# Altium project PDB26.PrjPcb (part 2 of 3)

## Sheet 12V_Buck_fans.SchDoc
size A; SheetNumber: 7; SheetTotal: 17
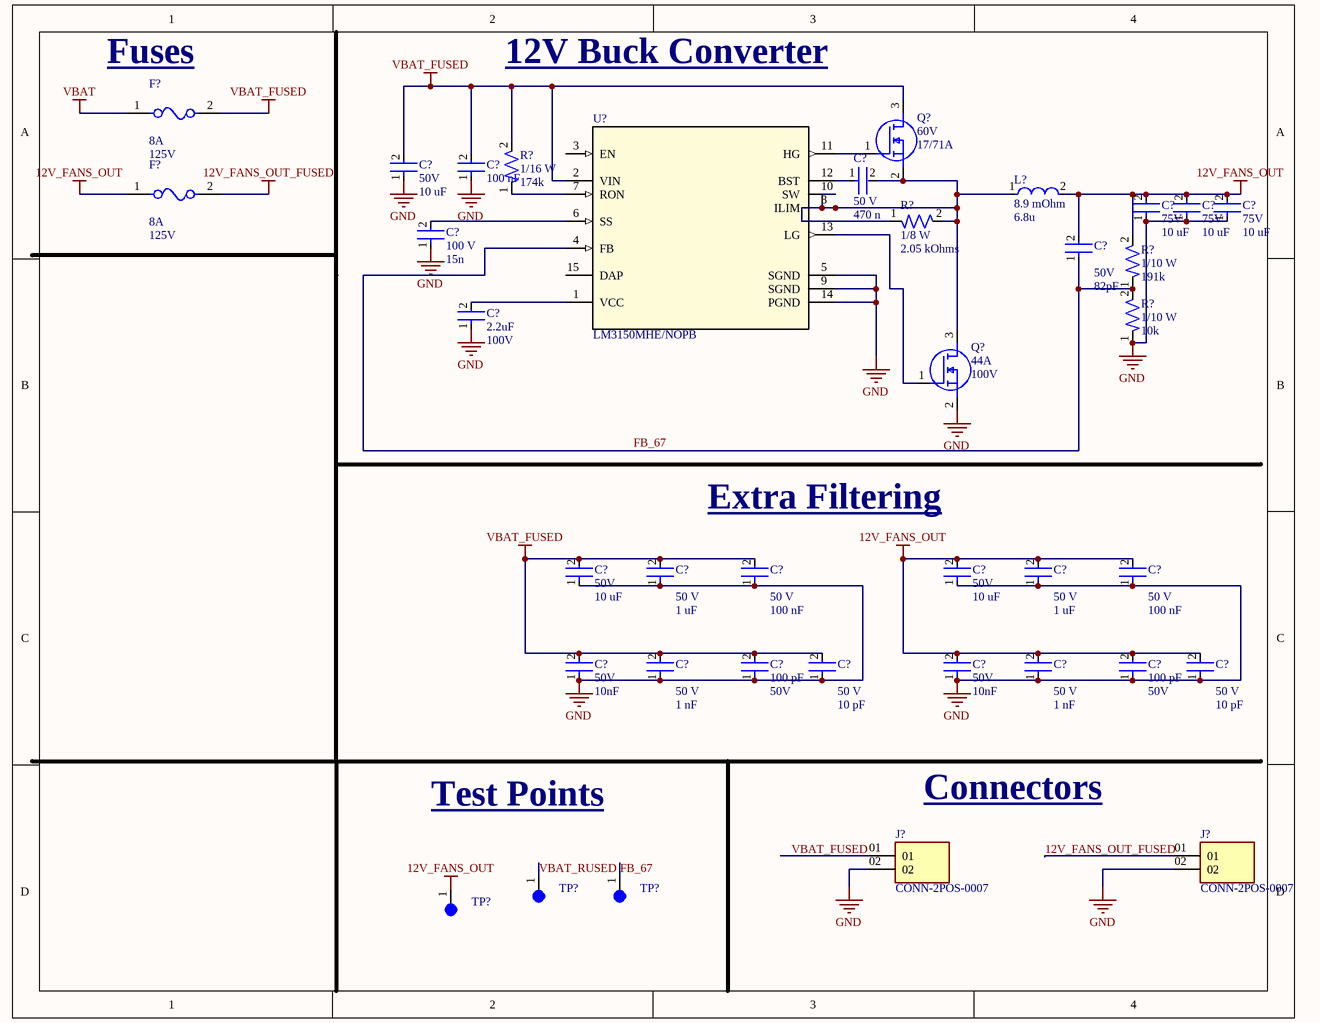
[diagram p6: 12V_Buck_fans.SchDoc]

### Parts
(Parts that share a designator on the sheet are numbered #1, #2 ... from top to bottom, then left to right.)
C?#113  Capacitance: 100 nF  [CAP-0603]  (hidden comment: GMC10X7S104K100NT)
C?#114  Voltage: 50V  Capacitance: 10 uF  [CAP-1210]  (hidden comment: CL32B106KBJNNNE)
C?#115  Voltage: 50 V  Capacitance: 470 n  [CAP-0805]  (hidden comment: CC0805ZRY5V9BB474)
C?#116  Voltage: 75V  Capacitance: 10 uF  [CAP-1210-0001]  (hidden comment: C3225X7R1N106K250AC)
C?#117  Voltage: 75V  Capacitance: 10 uF  [CAP-1210-0001]  (hidden comment: C3225X7R1N106K250AC)
C?#118  Voltage: 75V  Capacitance: 10 uF  [CAP-1210-0001]  (hidden comment: C3225X7R1N106K250AC)
C?#119  Voltage: 100 V  Capacitance: 15n  [CAP-0805]  (hidden comment: CC0805KRX7R0BB153)
C?#120  Voltage: 50V  Capacitance: 82pF  [CAP-0805]  (hidden comment: CC0805JRNPO9BN820)
C?#121  Capacitance: 2.2uF  Voltage: 100V  [CAP-1206]  (hidden comment: CC1206KKX7R0BB225)
C?#122  Voltage: 50 V  Capacitance: 1 uF  [CAP-0805]  (hidden comment: CC0805KKX7R9BB105)
C?#123  Voltage: 50 V  Capacitance: 100 nF  [CAP-0805]  (hidden comment: CC0805KRX7R9BB104)
C?#124  Voltage: 50 V  Capacitance: 1 uF  [CAP-0805]  (hidden comment: CC0805KKX7R9BB105)
C?#125  Voltage: 50 V  Capacitance: 100 nF  [CAP-0805]  (hidden comment: CC0805KRX7R9BB104)
C?#126  Voltage: 50V  Capacitance: 10 uF  [CAP-1210]  (hidden comment: CL32B106KBJNNNE)
C?#127  Voltage: 50V  Capacitance: 10 uF  [CAP-1210]  (hidden comment: CL32B106KBJNNNE)
C?#128  Voltage: 50 V  Capacitance: 1 nF  [CAP-0402]  (hidden comment: CC0402KRX7R9BB102)
C?#129  Voltage: 50 V  Capacitance: 10 pF  [CAP-0402]  (hidden comment: CC0402JRNPO9BN100)
C?#130  Voltage: 50 V  Capacitance: 1 nF  [CAP-0402]  (hidden comment: CC0402KRX7R9BB102)
C?#131  Voltage: 50 V  Capacitance: 10 pF  [CAP-0402]  (hidden comment: CC0402JRNPO9BN100)
C?#132  Voltage: 50V  Capacitance: 10nF  [CAP-0805]  (hidden comment: GRM2195C1H103JA01D)
C?#133  Capacitance: 100 pF  Voltage: 50V  [CAP-0402]  (hidden comment: CC0402JRNPO9BN101)
C?#134  Voltage: 50V  Capacitance: 10nF  [CAP-0805]  (hidden comment: GRM2195C1H103JA01D)
C?#135  Capacitance: 100 pF  Voltage: 50V  [CAP-0402]  (hidden comment: CC0402JRNPO9BN101)
F?#11  Fuse Current: 8A  Voltage Rating: 125V  [FUSE-0001]  (hidden comment: 01550900M)
F?#12  Fuse Current: 8A  Voltage Rating: 125V  [FUSE-0001]  (hidden comment: 01550900M)
J?#11  CONN-2POS-0007  [SAMTEC_HFWJ-02-02-T-S]
J?#12  CONN-2POS-0007  [SAMTEC_HFWJ-02-02-T-S]
L?#6  Resistance: 8.9 mOhm  Inductance: 6.8u  (hidden comment: XAL1010-682MED)
Q?#12  Vdss: 60V  Current: 17/71A  [NTMFS5C670NLT1G_ONS]  (hidden comment: NTMFS5C670NLT1G)
Q?#13  Current: 44A  Vdss: 100V  [TRANS_CSD19534Q5A]  (hidden comment: CSD19534Q5A)
R?#24  Power: 1/16 W  Resistance: 174k  [RES-0402]  (hidden comment: RC0402FR-07174KL)
R?#25  Power: 1/8 W  Resistance: 2.05 kOhms  [RES-0805]  (hidden comment: RC0805FR-072K05L)
R?#26  Power: 1/10 W  Resistance: 191k  [RES-0603]  (hidden comment: AC0603FR-07191KL)
R?#27  Power: 1/10 W  Resistance: 10k  [CAP-0603]  (hidden comment: RC0603FR-0710KL)
TP?#17  5003  [TEST-POINT-0001]  (value not drawn)
TP?#18  5003  [TEST-POINT-0001]  (value not drawn)
TP?#19  5003  [TEST-POINT-0001]  (value not drawn)
U?#6  LM3150MHE/NOPB  [MXA14A]

### Nets
12V_FANS_OUT: C?#116.2 C?#117.2 C?#118.2 C?#120.2 C?#124.2 C?#125.2 C?#127.2 C?#130.2 C?#131.2 C?#134.2 C?#135.2 F?#12.1 L?#6.2 R?#26.2 TP?#19.1
12V_FANS_OUT_FUSED: F?#12.2 J?#12.01
GND: C?#113.1 C?#114.1 C?#116.1 C?#117.1 C?#118.1 C?#119.1 C?#121.1 C?#122.1 C?#123.1 C?#124.1 C?#125.1 C?#126.1 C?#127.1 C?#128.1 C?#129.1 C?#130.1 C?#131.1 C?#132.1 C?#133.1 C?#134.1 C?#135.1 J?#11.02 J?#12.02 Q?#13.2(S) R?#27.1 U?#6.5(SGND) U?#6.9(SGND) U?#6.14(PGND)
VBAT: F?#11.1
VBAT_FUSED: C?#113.2 C?#114.2 C?#122.2 C?#123.2 C?#126.2 C?#128.2 C?#129.2 C?#132.2 C?#133.2 F?#11.2 Q?#12.3(D) R?#24.2 U?#6.2(VIN)
FB_67: C?#120.1 R?#26.1 R?#27.2 TP?#18.1 U?#6.4(FB)
VBAT_RUSED: TP?#17.1
NetC?#115_1: C?#115.1 U?#6.12(BST)
NetC?#115_2: C?#115.2 L?#6.1 Q?#12.2(S) Q?#13.3(D) R?#25.1 R?#25.2 U?#6.8(ILIM) U?#6.10(SW)
NetC?#119_2: C?#119.2 U?#6.6(SS)
NetC?#121_2: C?#121.2 U?#6.1(VCC)
NetQ?#12_1: Q?#12.1(G) U?#6.11(HG)
NetQ?#13_1: Q?#13.1(G) U?#6.13(LG)
NetR?#24_1: R?#24.1 U?#6.7(RON)

Not connected (* = marked no-connect by the designer): J?#11 01; U?#6 3(EN) 15(DAP)

### Notes on the sheet
- (near F?#11) Fuses
- 12V Buck Converter
- (near C?#123) Extra Filtering
- Test Points
- Connectors
- Labels drawn without touching a wire or pin: VBAT_FUSED

### Library data of the parts
C?#113 = CAP-100N-0001: 0.1 µF ±10% 100V Ceramic Capacitor X7S 0603 (1608 Metric)
C?#114 C?#126 C?#127 = CAP-10U-0002: CAP CER 10UF 50V X7R 1210; Device Class: Ceramic; Size: 1210; ComponentLink1Description: Datasheet; ComponentLink1URL: https://mm.digikey.com/Volume0/opasdata/d220001/medias/docus/41/CL32B106KBJNNNE_Spec.pdf
C?#115 = CAP-470N-0002: 0.47 µF -20%, +80% 50V Ceramic Capacitor Y5V (F) 0805 (2012 Metric)
C?#116-C?#118 = CAP-10U-0003: CAP CER 10UF 75V X7R 1210; Device Class: Ceramic; Size: 1210; ComponentLink1Description: Datasheet; ComponentLink1URL: https://mm.digikey.com/Volume0/opasdata/d220001/medias/docus/41/CL32B106KBJNNNE_Spec.pdf
C?#119 = CAP-15N-0001: 0.015 µF ±10% 100V Ceramic Capacitor X7R 0805 (2012 Metric)
C?#120 = CAP-82P-0001: 82 pF ±5% 50V Ceramic Capacitor C0G, NP0 0805 (2012 Metric)
C?#121 = CAP-2.2U-0001: CAP CER 2.2UF 100V X7R 1206; Device Class: Ceramic; Size: 1206; ComponentLink1Description: Datasheet; ComponentLink1URL: https://www.yageo.com/upload/media/product/productsearch/datasheet/mlcc/UPY-GPHC_X7R_6.3V-to-250V_24.pdf
C?#122 C?#124 = CAP-1U-0001: 1 µF ±10% 50V Ceramic Capacitor X7R 0805 (2012 Metric)
C?#123 C?#125 = CAP-100N-0002: 0.1 µF ±10% 50V Ceramic Capacitor X7R 0805 (2012 Metric)
C?#128 C?#130 = CAP-1N-0001: 1000 pF ±10% 50V Ceramic Capacitor X7R 0402 (1005 Metric)
C?#129 C?#131 = CAP-10P-0001: 10 pF ±5% 50V Ceramic Capacitor C0G, NP0 0402 (1005 Metric)
C?#132 C?#134 = CAP-10N-0001: CAP CER 10000PF 50V C0G/NP0 0805; Device Class: Ceramic; Size: 0805; ComponentLink1Description: Datasheet; ComponentLink1URL: https://search.murata.co.jp/Ceramy/image/img/A01X/G101/ENG/GRM2195C1H103JA01-01.pdf
C?#133 C?#135 = CAP-100P-0001: CAP CER 100PF 50V C0G/NPO 0402; Device Class: Ceramic; Size: 0402; ComponentLink1Description: Datasheet; ComponentLink1URL: https://www.yageo.com/upload/media/product/productsearch/datasheet/mlcc/UPY-GP_NP0_16V-to-50V_18.pdf
F?#11 F?#12 = FUSE-0001: FUSE BLOK CARTRIDGE 125V 10A SMD; ComponentLink2Description: Datasheet; ComponentLink2URL: https://www.littelfuse.com/~/media/electronics/datasheets/fuses/littelfuse_fuse_154_154t_154l_154tl_datasheet.pdf.pdf
J?#11 J?#12 = CONN-2POS-0007: Conn Unshrouded Header HDR 2 POS 3.96mm Solder ST Thru-Hole Bulk; MF: Samtec; MP: HFWJ-02-02-T-S; SnapEDA_Link: https://www.snapeda.com/parts/HFWJ-02-02-T-S/Samtec/view-part/?ref=snap; Package: None; Value: *; Check_prices: https://www.snapeda.com/parts/HFWJ-02-02-T-S/Samtec/view-part/?ref=eda
L?#6 = IND-6.8u-0001: 6.8 µH Shielded Molded Inductor 14 A 8.9mOhm Max Nonstandard
Q?#12 = MOS-17/71A-0001: MOSFET N-CH 60V 17A/71A 5DFN; Manufacturer_Name: onsemi; Vth: 2V; Copyright: Copyright (C) 2025 Ultra Librarian. All rights reserved.; Manufacturer_Part_Number: NTMFS5C670NLT1G; RefDes: RefDes; Type: Type
Q?#13 = MOS-44A-0001: 100V, N ch NexFET MOSFET, single SON5x6, 15.1mOhm 8-VSONP -55 to 150; MF: Texas Instruments; Vth: 3.4V; Mouser-Purchase-URL: https://snapeda.com/shop?store=Mouser&id=485742; Package: VSONP-8 Texas Instruments; Texas_Instruments-Purchase-URL: https://snapeda.com/shop?store=Texas+Instruments&id=485742; Value: *; Price: None; DigiKey-Purchase-URL: https://snapeda.com/shop?store=DigiKey&id=485742; MP: CSD19534Q5A; SnapEDA_Link: https://www.snapeda.com/parts/CSD19534Q5A/Texas%20Instruments/view-part/485742/?ref=snap; Availability: Good
R?#24 = RES-174K-0001: RES 174K OHM 1% 1/16W 0402
R?#25 = RES-2.05k-0001: 2.05 kOhms ±1% 0.125W, 1/8W Chip Resistor 0805 (2012 Metric) Moisture Resistant Thick Film
R?#26 = RES-191K-001: 191 kOhms ±1% 0.1W, 1/10W Chip Resistor 0603 (1608 Metric) Automotive AEC-Q200, Moisture Resistant Thick Film
R?#27 = RES-10k-0002: 10 kOhms ±1% 0.1W, 1/10W Chip Resistor 0603 (1608 Metric) Moisture Resistant Thick Film
TP?#17-TP?#19 = TEST-POINT-0001: as TP?#1 on sheet 24V_Buck_LA
U?#6 = IC-BUCK_0011: 6V to 42V Synchronous Step-Down Controller with Adjustable Output Voltage 14-HTSSOP -40 to 125; Manufacturer_Name: Texas Instruments; Copyright: Copyright (C) 2025 Ultra Librarian. All rights reserved.; Manufacturer_Part_Number: LM3150MHE/NOPB; Datasheet: https://www.ti.com/lit/gpn/lm3150; RefDes: RefDes; Type: Type

## Sheet 7V_Buck.SchDoc
size A; SheetNumber: 5; SheetTotal: 16
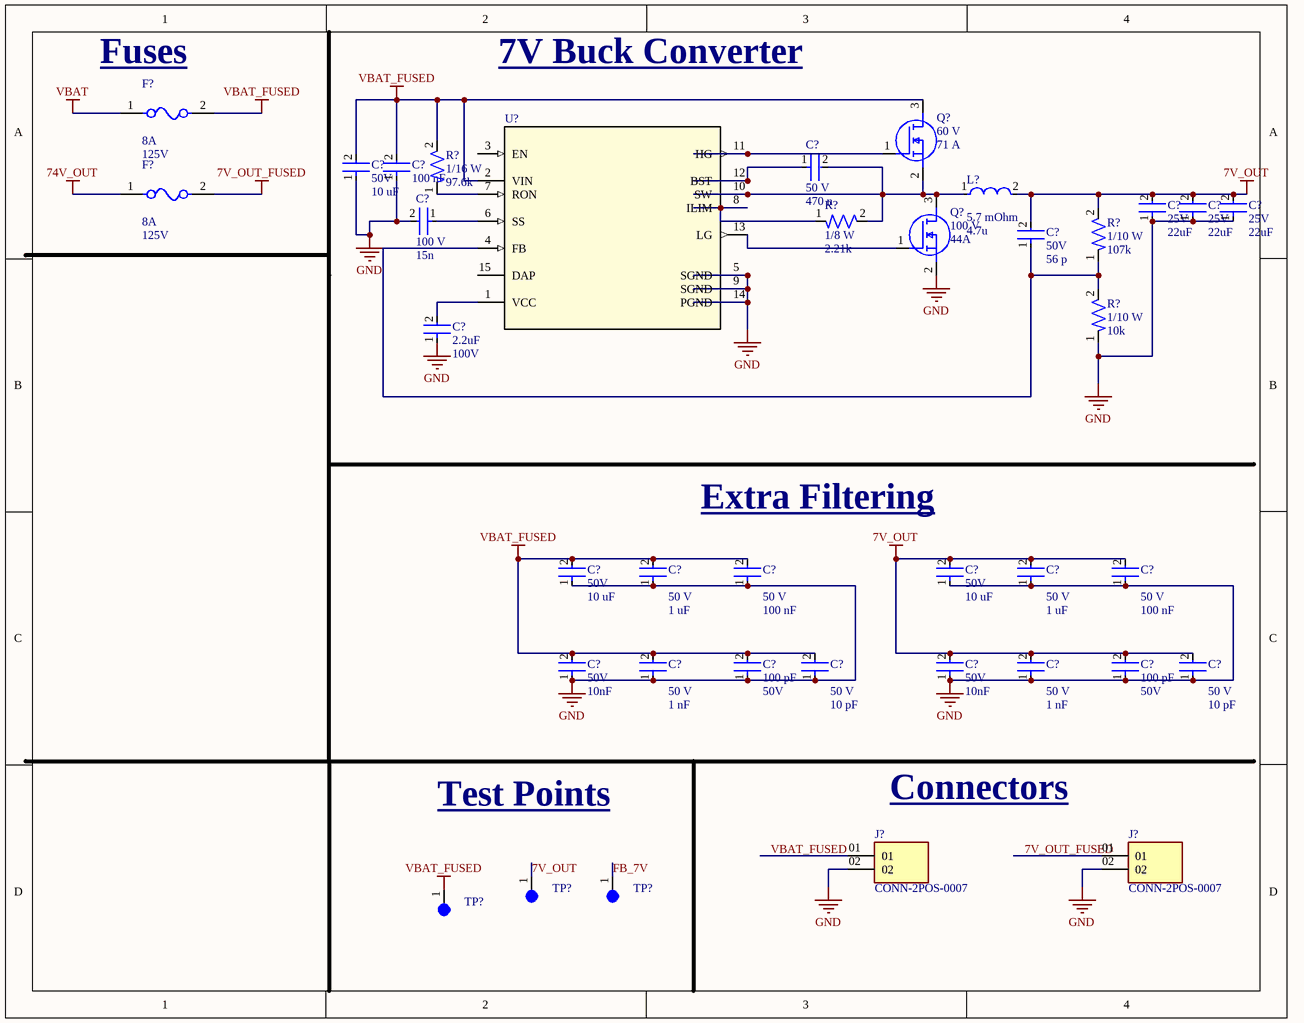
[diagram p7: 7V_Buck.SchDoc]

### Parts
(Parts that share a designator on the sheet are numbered #1, #2 ... from top to bottom, then left to right.)
C?#136  Capacitance: 100 nF  [CAP-0603]  (hidden comment: GMC10X7S104K100NT)
C?#137  Voltage: 50 V  Capacitance: 470 n  [CAP-0805]  (hidden comment: CC0805ZRY5V9BB474)
C?#138  Voltage: 50V  Capacitance: 10 uF  [CAP-1210]  (hidden comment: CL32B106KBJNNNE)
C?#139  Voltage: 100 V  Capacitance: 15n  [CAP-0805]  (hidden comment: CC0805KRX7R0BB153)
C?#140  Voltage: 25V  Capacitance: 22uF  [CAP-1210]  (hidden comment: GRM32ER61E226KE15L)
C?#141  Voltage: 25V  Capacitance: 22uF  [CAP-1210]  (hidden comment: GRM32ER61E226KE15L)
C?#142  Voltage: 25V  Capacitance: 22uF  [CAP-1210]  (hidden comment: GRM32ER61E226KE15L)
C?#143  Voltage: 50V  Capacitance: 56 p  [CAP-0402]  (hidden comment: CC0402JRNPO9BN560)
C?#144  Capacitance: 2.2uF  Voltage: 100V  [CAP-1206]  (hidden comment: CC1206KKX7R0BB225)
C?#145  Voltage: 50 V  Capacitance: 1 uF  [CAP-0805]  (hidden comment: CC0805KKX7R9BB105)
C?#146  Voltage: 50 V  Capacitance: 100 nF  [CAP-0805]  (hidden comment: CC0805KRX7R9BB104)
C?#147  Voltage: 50 V  Capacitance: 1 uF  [CAP-0805]  (hidden comment: CC0805KKX7R9BB105)
C?#148  Voltage: 50 V  Capacitance: 100 nF  [CAP-0805]  (hidden comment: CC0805KRX7R9BB104)
C?#149  Voltage: 50V  Capacitance: 10 uF  [CAP-1210]  (hidden comment: CL32B106KBJNNNE)
C?#150  Voltage: 50V  Capacitance: 10 uF  [CAP-1210]  (hidden comment: CL32B106KBJNNNE)
C?#151  Voltage: 50 V  Capacitance: 1 nF  [CAP-0402]  (hidden comment: CC0402KRX7R9BB102)
C?#152  Voltage: 50 V  Capacitance: 10 pF  [CAP-0402]  (hidden comment: CC0402JRNPO9BN100)
C?#153  Voltage: 50 V  Capacitance: 1 nF  [CAP-0402]  (hidden comment: CC0402KRX7R9BB102)
C?#154  Voltage: 50 V  Capacitance: 10 pF  [CAP-0402]  (hidden comment: CC0402JRNPO9BN100)
C?#155  Voltage: 50V  Capacitance: 10nF  [CAP-0805]  (hidden comment: GRM2195C1H103JA01D)
C?#156  Capacitance: 100 pF  Voltage: 50V  [CAP-0402]  (hidden comment: CC0402JRNPO9BN101)
C?#157  Voltage: 50V  Capacitance: 10nF  [CAP-0805]  (hidden comment: GRM2195C1H103JA01D)
C?#158  Capacitance: 100 pF  Voltage: 50V  [CAP-0402]  (hidden comment: CC0402JRNPO9BN101)
F?#13  Fuse Current: 8A  Voltage Rating: 125V  [FUSE-0001]  (hidden comment: 01550900M)
F?#14  Fuse Current: 8A  Voltage Rating: 125V  [FUSE-0001]  (hidden comment: 01550900M)
J?#13  CONN-2POS-0007  [SAMTEC_HFWJ-02-02-T-S]
J?#14  CONN-2POS-0007  [SAMTEC_HFWJ-02-02-T-S]
L?#7  Resistance: 5.7 mOhm  Inductance: 4.7u  [IND_XAL1010_COC]  (hidden comment: XAL1010-472MED)
Q?#14  Voltage Max: 100 V  Current Max: 44A  [TRANS_CSD19534Q5A]  (hidden comment: CSD19534Q5A)
Q?#15  Max Voltage: 60 V  Max Current: 71 A  [NTMFS5C670NLT1G_ONS]  (hidden comment: NTMFS5C670NLT1G)
R?#28  Power: 1/16 W  Resistance: 97.6k  [RES-0402]  (hidden comment: RC0402FR-0797K6L)
R?#29  Power: 1/8 W  Resistance: 2.21k  [RES-0805]  (hidden comment: RT0805BRD072K21L)
R?#30  Power: 1/10 W  Resistance: 107k  [RES-0603]  (hidden comment: RC0603FR-07107KL)
R?#31  Power: 1/10 W  Resistance: 10k  [CAP-0603]  (hidden comment: RC0603FR-0710KL)
TP?#20  5003  [TEST-POINT-0001]  (value not drawn)
TP?#21  5003  [TEST-POINT-0001]  (value not drawn)
TP?#22  5003  [TEST-POINT-0001]  (value not drawn)
U?#7  LM3150MHE/NOPB  [MXA14A]  (value not drawn)

### Nets
7V_OUT: C?#140.2 C?#141.2 C?#142.2 C?#143.2 C?#147.2 C?#148.2 C?#150.2 C?#153.2 C?#154.2 C?#157.2 C?#158.2 L?#7.2 R?#30.2 TP?#20.1
7V_OUT_FUSED: F?#14.2
74V_OUT: F?#14.1
GND: C?#136.1 C?#138.1 C?#139.2 C?#140.1 C?#141.1 C?#142.1 C?#144.1 C?#145.1 C?#146.1 C?#147.1 C?#148.1 C?#149.1 C?#150.1 C?#151.1 C?#152.1 C?#153.1 C?#154.1 C?#155.1 C?#156.1 C?#157.1 C?#158.1 J?#13.02 J?#14.02 Q?#14.2(S) R?#31.1 U?#7.5(SGND) U?#7.9(SGND) U?#7.14(PGND)
VBAT: F?#13.1
VBAT_FUSED: C?#136.2 C?#138.2 C?#145.2 C?#146.2 C?#149.2 C?#151.2 C?#152.2 C?#155.2 C?#156.2 F?#13.2 Q?#15.3(D) R?#28.2 TP?#22.1 U?#7.2(VIN)
FB_7V: TP?#21.1
NetC?#137_1: C?#137.1 U?#7.12(BST)
NetC?#137_2: C?#137.2 L?#7.1 Q?#14.3(D) Q?#15.2(S) R?#29.2 U?#7.10(SW)
NetC?#139_1: C?#139.1 U?#7.6(SS)
NetC?#143_1: C?#143.1 R?#30.1 R?#31.2 U?#7.4(FB)
NetC?#144_2: C?#144.2 U?#7.1(VCC)
NetQ?#14_1: Q?#14.1(G) U?#7.13(LG)
NetQ?#15_1: Q?#15.1(G) U?#7.11(HG)
NetR?#28_1: R?#28.1 U?#7.7(RON)
NetR?#29_1: R?#29.1 U?#7.8(ILIM)

Not connected (* = marked no-connect by the designer): J?#13 01; J?#14 01; U?#7 3(EN) 15(DAP)

### Notes on the sheet
- (near F?#13) Fuses
- 7V Buck Converter
- (near C?#146) Extra Filtering
- Test Points
- (near J?#13) Connectors
- Labels drawn without touching a wire or pin: 7V_OUT_FUSED, VBAT_FUSED

### Library data of the parts
C?#136 = CAP-100N-0001: as C?#113 on sheet 12V_Buck_fans
C?#137 = CAP-470N-0002: as C?#115 on sheet 12V_Buck_fans
C?#138 C?#149 C?#150 = CAP-10U-0002: CAP CER 10UF 50V X7R 1210; Device Class: Ceramic; Size: 1210; ComponentLink1Description: Datasheet; ComponentLink1URL: https://mm.digikey.com/Volume0/opasdata/d220001/medias/docus/41/CL32B106KBJNNNE_Spec.pdf
C?#139 = CAP-15N-0001: as C?#119 on sheet 12V_Buck_fans
C?#140-C?#142 = CAP-22U-0001: CAP CER 22UF 25V X5R 1210; ComponentLink2Description: Datasheet; ComponentLink2URL: https://search.murata.co.jp/Ceramy/image/img/A01X/G101/ENG/GRM32ER61E226KE15-01A.pdf; Device Class: Ceramic; Size: 1210
C?#143 = CAP-56p-0001: 56 pF ±5% 50V Ceramic Capacitor C0G, NP0 0402 (1005 Metric)
C?#144 = CAP-2.2U-0001: CAP CER 2.2UF 100V X7R 1206; Device Class: Ceramic; Size: 1206; ComponentLink1Description: Datasheet; ComponentLink1URL: https://www.yageo.com/upload/media/product/productsearch/datasheet/mlcc/UPY-GPHC_X7R_6.3V-to-250V_24.pdf
C?#145 C?#147 = CAP-1U-0001: as C?#122 on sheet 12V_Buck_fans
C?#146 C?#148 = CAP-100N-0002: as C?#123 on sheet 12V_Buck_fans
C?#151 C?#153 = CAP-1N-0001: as C?#128 on sheet 12V_Buck_fans
C?#152 C?#154 = CAP-10P-0001: as C?#129 on sheet 12V_Buck_fans
C?#155 C?#157 = CAP-10N-0001: CAP CER 10000PF 50V C0G/NP0 0805; Device Class: Ceramic; Size: 0805; ComponentLink1Description: Datasheet; ComponentLink1URL: https://search.murata.co.jp/Ceramy/image/img/A01X/G101/ENG/GRM2195C1H103JA01-01.pdf
C?#156 C?#158 = CAP-100P-0001: CAP CER 100PF 50V C0G/NPO 0402; Device Class: Ceramic; Size: 0402; ComponentLink1Description: Datasheet; ComponentLink1URL: https://www.yageo.com/upload/media/product/productsearch/datasheet/mlcc/UPY-GP_NP0_16V-to-50V_18.pdf
F?#13 F?#14 = FUSE-0001: FUSE BLOK CARTRIDGE 125V 10A SMD; ComponentLink2Description: Datasheet; ComponentLink2URL: https://www.littelfuse.com/~/media/electronics/datasheets/fuses/littelfuse_fuse_154_154t_154l_154tl_datasheet.pdf.pdf
J?#13 J?#14 = CONN-2POS-0007: as J?#11 on sheet 12V_Buck_fans; SnapEDA_Link: https://www.snapeda.com/parts/HFWJ-02-02-T-S/Samtec/view-part/?ref=snap; Package: None; Value: *; Check_prices: https://www.snapeda.com/parts/HFWJ-02-02-T-S/Samtec/view-part/?ref=eda
L?#7 = IND-4.7u-0001: 4.7 ÂµH Shielded Molded Inductor 17.5 A 5.7mOhm Max Nonstandard
Q?#14 = NMOS-44A-0001: N-Channel 100 V 44A (Tc) 3.2W (Ta), 63W (Tc) Surface Mount 8-VSONP (5x6); MF: Texas Instruments; Mouser-Purchase-URL: https://snapeda.com/shop?store=Mouser&id=485742; Package: VSONP-8 Texas Instruments; Texas_Instruments-Purchase-URL: https://snapeda.com/shop?store=Texas+Instruments&id=485742; Value: *; Price: None; DigiKey-Purchase-URL: https://snapeda.com/shop?store=DigiKey&id=485742; MP: CSD19534Q5A; SnapEDA_Link: https://www.snapeda.com/parts/CSD19534Q5A/Texas%20Instruments/view-part/485742/?ref=snap; Availability: Good
Q?#15 = NMOS-71A-0001: N-Channel 60 V 17A (Ta), 71A (Tc) 3.6W (Ta), 61W (Tc) Surface Mount 5-DFN (5x6) (8-SOFL); Manufacturer_Name: onsemi; Copyright: Copyright (C) 2025 Ultra Librarian. All rights reserved.; Manufacturer_Part_Number: NTMFS5C670NLT1G; RefDes: RefDes; Type: Type
R?#28 = RES-97.6k-0001: 97.6 kOhms ±1% 0.063W, 1/16W Chip Resistor 0402 (1005 Metric) Moisture Resistant Thick Film
R?#29 = RES-2.21K-0001: 2.21 kOhms ±0.1% 0.125W, 1/8W Chip Resistor 0805 (2012 Metric) Thin Film
R?#30 = RES-107k-0001: as R?#6 on sheet 24V_Buck_LA
R?#31 = RES-10k-0002: as R?#27 on sheet 12V_Buck_fans
TP?#20-TP?#22 = TEST-POINT-0001: as TP?#1 on sheet 24V_Buck_LA
U?#7 = IC-BUCK_0011: as U?#6 on sheet 12V_Buck_fans; Copyright: Copyright (C) 2025 Ultra Librarian. All rights reserved.; Manufacturer_Part_Number: LM3150MHE/NOPB; Datasheet: https://www.ti.com/lit/gpn/lm3150; RefDes: RefDes; Type: Type

## Sheet MCU.SchDoc
size 381 x 241 mm; SheetNumber: 5; SheetTotal: 8
Used 2 times, as channels B9, B6. Parts and nets are listed once, with the designators drawn on the sheet.
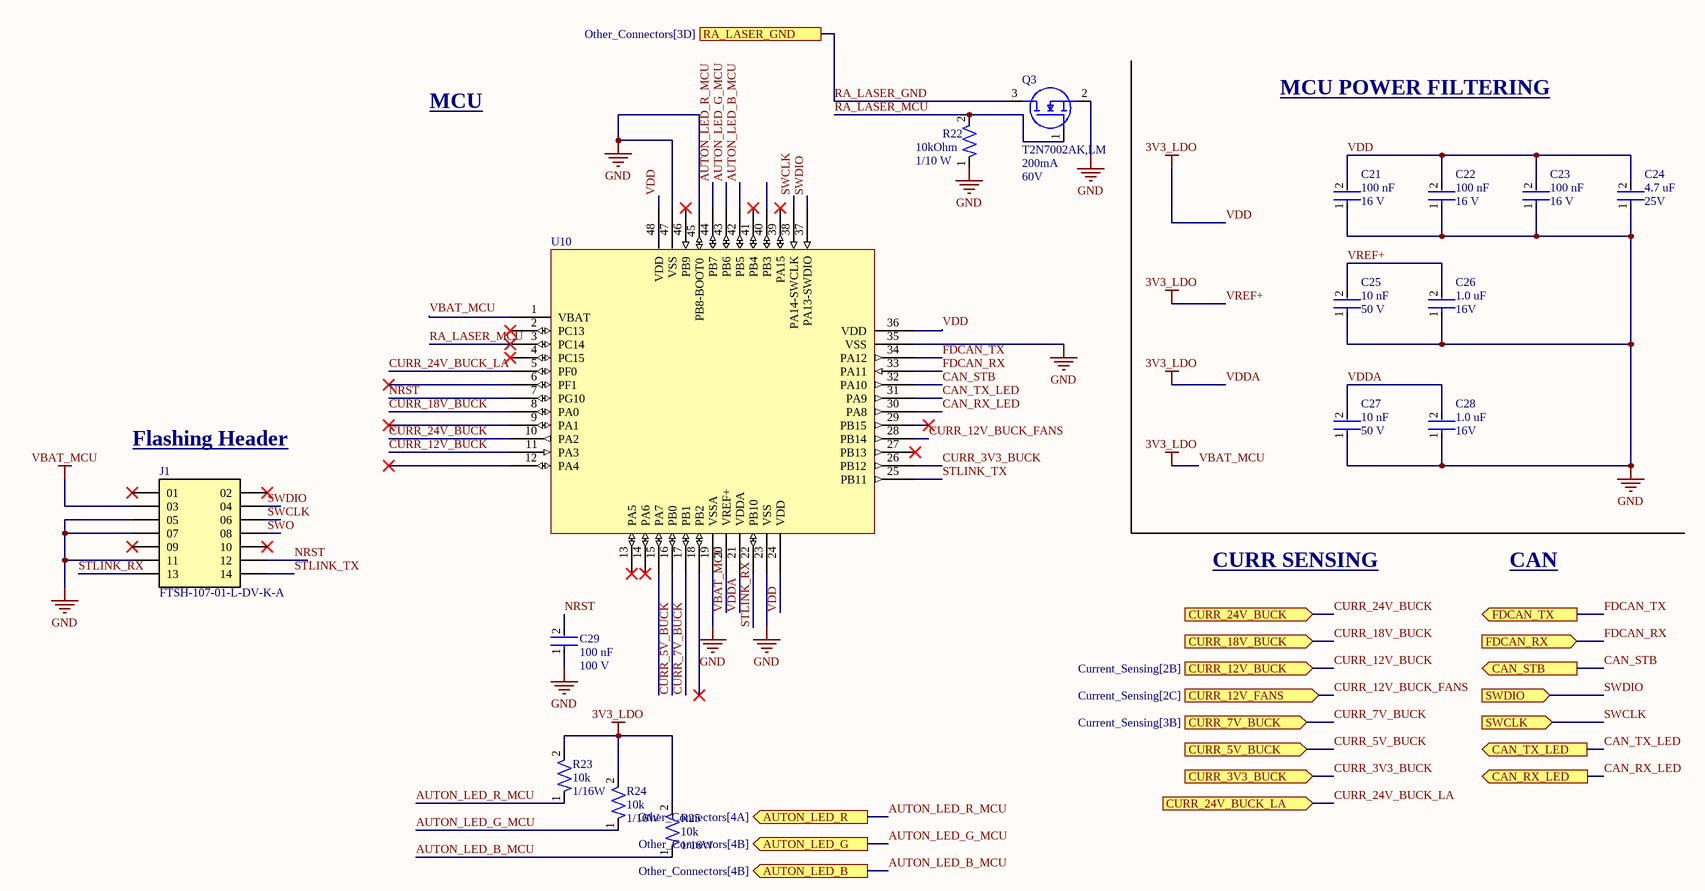
[diagram p8: MCU.SchDoc]

### Parts
C21  Voltage Rating: 16 V  Capacitance: 100 nF  [CAP-0402]  (hidden comment: CC0402KRX7R7BB104)
C22  Voltage Rating: 16 V  Capacitance: 100 nF  [CAP-0402]  (hidden comment: CC0402KRX7R7BB104)
C23  Voltage Rating: 16 V  Capacitance: 100 nF  [CAP-0402]  (hidden comment: CC0402KRX7R7BB104)
C24  Capacitance: 4.7 uF  Voltage: 25V  [CAP-0603]  (hidden comment: CC0603KRX5R8BB475)
C25  Voltage: 50 V  Capacitance: 10 nF  [CAP-0603]  (hidden comment: CC0603KPX7R9BB103)
C26  Capacitance: 1.0 uF  Voltage: 16V  [CAP-0603]  (hidden comment: CC0603KRX7R7BB105)
C27  Voltage: 50 V  Capacitance: 10 nF  [CAP-0603]  (hidden comment: CC0603KPX7R9BB103)
C28  Capacitance: 1.0 uF  Voltage: 16V  [CAP-0603]  (hidden comment: CC0603KRX7R7BB105)
C29  Capacitance: 100 nF  Voltage: 100 V  [CAP-0603]  (hidden comment: CC0603KRX7R0BB104)
J1  FTSH-107-01-L-DV-K-A  [SAMTEC_FTSH-107-01-L-DV-K]
Q3  T2N7002AK,LM  Id-Continuous: 200mA  VDS-Max: 60V  [NMOS-SOT23-3]
R22  Resistance: 10kOhm  Power: 1/10 W  [RES-0603]  (hidden comment: RMCF0603ZT0R00)
R23  Resistance: 10k  Power: 1/16W  [RES-0402]  (hidden comment: RC0402FR-0710KL)
R24  Resistance: 10k  Power: 1/16W  [RES-0402]  (hidden comment: RC0402FR-0710KL)
R25  Resistance: 10k  Power: 1/16W  [RES-0402]  (hidden comment: RC0402FR-0710KL)
U10  STM32G431CBT6  [IC-LQFP48]  (value not drawn)

### Ports
AUTON_LED_B (out, see Other_Connectors[4B]), AUTON_LED_G (out, see Other_Connectors[4B]), AUTON_LED_R (out, see Other_Connectors[4A]), CAN_RX_LED (out, see CAN_Transciever[1C]), CAN_STB (out, see CAN_Transciever[1C]), CAN_TX_LED (out, see CAN_Transciever[1C]), CURR_3V3_BUCK (in, see Current_Sensing[5B]), CURR_5V_BUCK (in, see Current_Sensing[5B]), CURR_7V_BUCK (in, see Current_Sensing[3B]), CURR_12V_BUCK (in, see Current_Sensing[2B]), CURR_12V_FANS (in, see Current_Sensing[2C]), CURR_18V_BUCK (in, see Current_Sensing[3B]), CURR_24V_BUCK (in, see Current_Sensing[2B]), CURR_24V_BUCK_LA (in, see Current_Sensing[4C]), FDCAN_RX (in, see CAN_Transciever[1C]), FDCAN_TX (out, see CAN_Transciever[1C]), RA_LASER_GND (see Other_Connectors[3D]), SWCLK (in), SWDIO (in)

### Nets
GND: C21.1 C22.1 C23.1 C24.1 C25.1 C26.1 C27.1 C28.1 C29.1 J1.05 J1.07 J1.11 Q3.2(S) R22.1 U10.19(VSSA) U10.23(VSS) U10.35(VSS) U10.45(PB8-BOOT0) U10.47(VSS)
VBAT_MCU: C21.2 C22.2 C23.2 C24.2 C25.2 C26.2 C27.2 C28.2 J1.03 R23.2 R24.2 R25.2 U10.1(VBAT) U10.20(VREF+) U10.21(VDDA) U10.24(VDD) U10.36(VDD) U10.48(VDD)  [also labelled 3V3_LDO, VDD, VDDA, VREF+]
AUTON_LED_B_MCU: R25.1 U10.42(PB5) ; port AUTON_LED_B
AUTON_LED_G_MCU: R24.1 U10.43(PB6) ; port AUTON_LED_G
AUTON_LED_R_MCU: R23.1 U10.44(PB7) ; port AUTON_LED_R
CAN_RX_LED: U10.30(PA8) ; port CAN_RX_LED
CAN_STB: U10.32(PA10) ; port CAN_STB
CAN_TX_LED: U10.31(PA9) ; port CAN_TX_LED
CURR_3V3_BUCK: U10.26(PB12) ; port CURR_3V3_BUCK
CURR_5V_BUCK: U10.16(PB0) ; port CURR_5V_BUCK
CURR_7V_BUCK: U10.17(PB1) ; port CURR_7V_BUCK
CURR_12V_BUCK: U10.11(PA3) ; port CURR_12V_BUCK
CURR_12V_BUCK_FANS: U10.28(PB14) ; port CURR_12V_FANS
CURR_18V_BUCK: U10.8(PA0) ; port CURR_18V_BUCK
CURR_24V_BUCK: U10.10(PA2) ; port CURR_24V_BUCK
CURR_24V_BUCK_LA: U10.5(PF0) ; port CURR_24V_BUCK_LA
FDCAN_RX: U10.33(PA11) ; port FDCAN_RX
FDCAN_TX: U10.34(PA12) ; port FDCAN_TX
NRST: C29.2 J1.12 U10.7(PG10)
RA_LASER_GND: Q3.3(D) ; port RA_LASER_GND
RA_LASER_MCU: Q3.1(G) R22.2 U10.3(PC14)
STLINK_RX: J1.13 U10.22(PB10)
STLINK_TX: J1.14 U10.25(PB11)
SWCLK: J1.06 U10.38(PA14-SWCLK) ; port SWCLK
SWDIO: J1.04 U10.37(PA13-SWDIO) ; port SWDIO
SWO: J1.08

Not connected (* = marked no-connect by the designer): J1 01* 02* 09* 10*; U10 2(PC13)* 4(PC15)* 6(PF1)* 9(PA1)* 12(PA4)* 13(PA5)* 14(PA6)* 15(PA7) 18(PB2)* 27(PB13)* 29(PB15)* 39(PA15)* 40(PB3) 41(PB4)* 46(PB9)*

### Channels
B9: designators end in _B9; ports AUTON_LED_B=AUTON_LED_B AUTON_LED_G=AUTON_LED_G AUTON_LED_R=AUTON_LED_R CAN_RX_LED=CAN_RX_LED CAN_STB=CAN_STB CAN_TX_LED=CAN_TX_LED CURR_3V3_BUCK=CURR_3V3_BUCK CURR_5V_BUCK=CURR_5V_BUCK CURR_7V_BUCK=CURR_7V_BUCK CURR_12V_BUCK=CURR_12V_BUCK CURR_12V_FANS=CURR_12V_BUCK_FANS CURR_18V_BUCK=CURR_18V_BUCK CURR_24V_BUCK=CURR_24V_BUCK CURR_24V_BUCK_LA=CURR_24V_BUCK_LA FDCAN_RX=FDCAN_RX FDCAN_TX=FDCAN_TX RA_LASER_GND=RA_LASER_GND SWCLK=SWCLK SWDIO=SWDIO
B6: designators end in _B6; ports AUTON_LED_B=AUTON_LED_B AUTON_LED_G=AUTON_LED_G AUTON_LED_R=AUTON_LED_R CAN_RX_LED=CAN_RX_LED CAN_STB=CAN_STB CAN_TX_LED=CAN_TX_LED CURR_3V3_BUCK=CURR_3V3_BUCK CURR_5V_BUCK=CURR_5V_BUCK CURR_7V_BUCK=CURR_7V_BUCK CURR_12V_BUCK=CURR_12V_BUCK CURR_12V_FANS=CURR_12V_BUCK_FANS CURR_18V_BUCK=CURR_18V_BUCK CURR_24V_BUCK=CURR_24V_BUCK CURR_24V_BUCK_LA=CURR_24V_BUCK_LA FDCAN_RX=FDCAN_RX FDCAN_TX=FDCAN_TX RA_LASER_GND=RA_LASER_GND SWCLK=SWCLK SWDIO=SWDIO

### Notes on the sheet
- MCU
- MCU POWER FILTERING
- (near J1) Flashing Header
- CURR SENSING
- CAN

### Library data of the parts
C21-C23 = CAP-0.1U-0001: CAP CER 0.1UF 16V X7R 0402; ComponentLink2Description: Datasheet; ComponentLink2URL: https://www.yageo.com/upload/media/product/productsearch/datasheet/mlcc/UPY-GPHC_X7R_6.3V-to-250V_24.pdf; Device Class: Ceramic; Size: 0402
C24 = CAP-4.7U-0001: CAP CER 4.7UF 25V X5R 0603; Device Class: Ceramic; Size: 0603
C25 C27 = CAP-10N-0002: CAP CER 10000PF 50V X7R 0603; ComponentLink2Description: Datasheet; ComponentLink2URL: http://www.yageo.com/documents/recent/UPY-GPHC_X7R_6.3V-to-50V_18.pdf; Device Class: Ceramic; Size: 0603
C26 C28 = CAP-1U-0002: CAP CER 1UF 16V X7R 0603; Device Class: Ceramic; Size: 0603
C29 = CAP-100N-0001: CAP CER 0.1UF 100V X7R 0603; Device Class: Ceramic; Size: 0603; ComponentLink1Description: Datasheet; ComponentLink1URL: https://www.yageo.com/upload/media/product/app/datasheet/mlcc/upy-np0x7r_mv_100-to-630v.pdf
J1 = CONN-Flashing: Connector Header Surface Mount 14 position 0.050 (1.27mm); MF: Samtec Inc.; SnapEDA_Link: https://www.snapeda.com/parts/FTSH-107-01-L-DV-K-A/Samtec+Inc./view-part/?ref=snap; Package: None; Value: *; MP: FTSH-107-01-L-DV-K-A; Check_prices: https://www.snapeda.com/parts/FTSH-107-01-L-DV-K-A/Samtec+Inc./view-part/?ref=eda; ComponentLink1Description: Datasheet; ComponentLink1URL: https://mm.digikey.com/Volume0/opasdata/d220001/medias/docus/6209/ftsh-1xx-xx-xxx-dv-xxx-xxx-x-xx-mkt.pdf?_gl=1*1c8qhrp*_up*MQ..*_gs*MQ..&gclid=Cj0KCQjwndHEBhDVARIsAGh0g3BhbAROHH0tQxim6dYiCi7CVIKM-WvKYR8T8zWoEwepZ3CPXWTcBI4aAtXsEALw_wcB&gclsrc=aw.ds&gbraid=0AAAAADrbLlju0DZp9CUD_BKsHNp-CszV5
Q3 = NMOS-200MA-0001: MOSFET N-CH 60V 200MA SOT23; Manufacturer: Toshiba; FET type: N-Channel; Rds On-Max: 3.9Ohm; Vgs-Max: 20V; Assembled?: no; Manufacturer Part Number: T2N7002AK,LM; Package: SOT-23-3
R22 = RES-0-0001: 0 Ohms Jumper 0.1W, 1/10W Chip Resistor 0603 (1608 Metric) Automotive AEC-Q200 Thick Film; Package Size: 0603
R23-R25 = RES-10k-0001: RES 10K OHM 1% 1/16W 0402; Tolerance: 1%; Size: 0402; ComponentLink1Description: Datasheet; ComponentLink1URL: https://www.yageo.com/upload/media/product/products/datasheet/rchip/PYu-RC_Group_51_RoHS_L_12.pdf
U10 = IC-STM32G431CBT6: IC MCU 32BIT 128KB FLASH 48LQFP; Package: 48LQFP; ComponentLink1Description: Datasheet; ComponentLink1URL: https://www.st.com/resource/en/datasheet/stm32g431cb.pdf

## Sheet Motherboard.SchDoc
size A; SheetNumber: 11; SheetTotal: 17
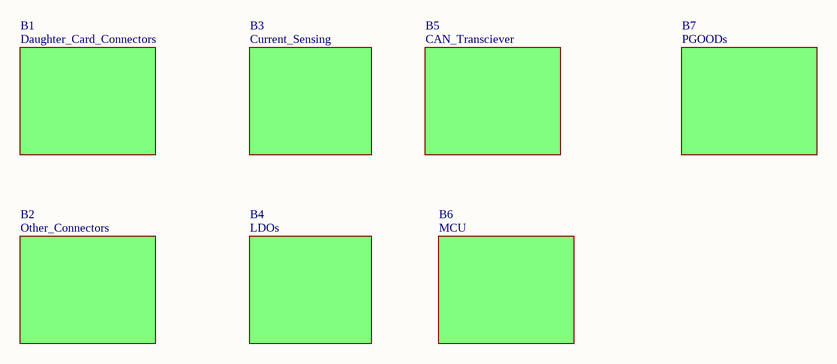
[diagram p9: Motherboard.SchDoc]

### Sub-sheets
B1 = Daughter_Card_Connectors (file not in this document): no entries
B2 = Other_Connectors: no entries
B3 = Current_Sensing: no entries
B4 = LDOs: no entries
B5 = CAN_Transciever: no entries
B6 = MCU: no entries
B7 = PGOODs: no entries

## Sheet Other_Connectors.SchDoc
size A; SheetNumber: 6; SheetTotal: 8
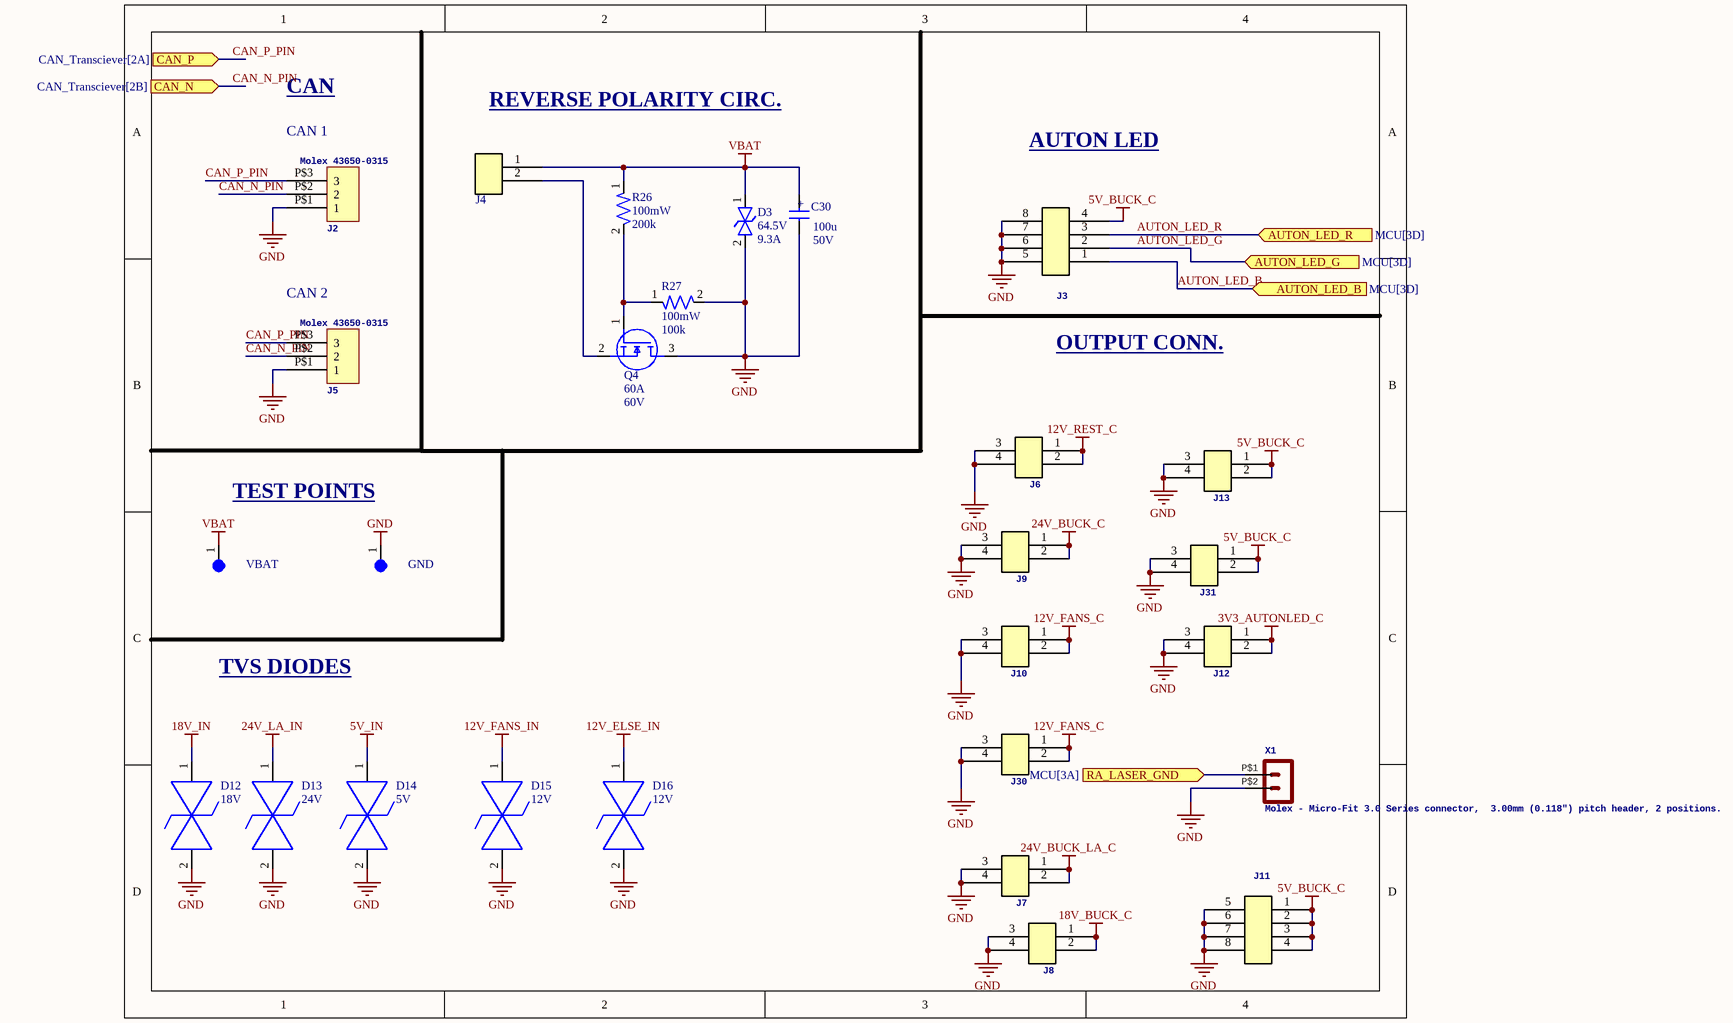
[diagram p10: Other_Connectors.SchDoc]

### Parts
C30  Capacitance: 100u  Voltage: 50V  [WCAP-ATUL_8X11.5(DXL)]  (hidden comment: 860040674004)
D3  Voltage Rating: 64.5V  Current Rating: 9.3A  [DO-214AA (SMBJ)]  (hidden comment: SMBJ40CA)
D12  Clamping Voltage: 18V  [SMBJSeries_LTF]  (hidden comment: SMBJ18)
D13  Voltage: 24V  [SMBJSeries_LTF]  (hidden comment: SMBJ24)
D14  Voltage: 5V  [SMBJSeries_LTF]  (hidden comment: SMBJ5.0)
D15  Voltage: 12V  [SMBJSeries_LTF]  (hidden comment: SMBJ12)
D16  Voltage: 12V  [SMBJSeries_LTF]  (hidden comment: SMBJ12)
GND  5003  [TEST-POINT-0001]  (value not drawn)
J2  Molex 43650-0315  [43650-0315]
J3  Molex 43045-0812  [CONN-8POS-0001]  (value not drawn)
J4  1546927-2  [CONN-1546927-2]  (value not drawn)
J5  Molex 43650-0315  [43650-0315]
J6  Molex 43045-0412  [CONN-4POS-0002]  (value not drawn)
J7  Molex 43045-0412  [CONN-4POS-0002]  (value not drawn)
J8  Molex 43045-0412  [CONN-4POS-0002]  (value not drawn)
J9  Molex 43045-0412  [CONN-4POS-0002]  (value not drawn)
J10  Molex 43045-0412  [CONN-4POS-0002]  (value not drawn)
J11  Molex 43045-0812  [CONN-8POS-0001]  (value not drawn)
J12  Molex 43045-0412  [CONN-4POS-0002]  (value not drawn)
J13  Molex 43045-0412  [CONN-4POS-0002]  (value not drawn)
J30  Molex 43045-0412  [CONN-4POS-0002]  (value not drawn)
J31  Molex 43045-0412  [CONN-4POS-0002]  (value not drawn)
Q4  Voltage: 60V  Continuous Current: 60A  [IC-8VSONCLIP]  (hidden comment: CSD18543Q3AT)
R26  Power: 100mW  Resistance: 200k  [RES-0603]  (hidden comment: RC0603FR-07200KL)
R27  Power: 100mW  Resistance: 100k  [RES-0603]  (hidden comment: RC0603FR-07100KL)
VBAT  5003  [TEST-POINT-0001]  (value not drawn)
X1  Molex - Micro-Fit 3.0 Series connector,  3.00mm (0.118") pitch header, 2 positions.  [43045-0212]

### Ports
AUTON_LED_B (in, see MCU[3D]), AUTON_LED_G (in, see MCU[3D]), AUTON_LED_R (in, see MCU[3D]), CAN_N (in, see CAN_Transciever[2B]), CAN_P (in, see CAN_Transciever[2A]), RA_LASER_GND (in, see MCU[3A])

### Nets
3V3_AUTONLED_C: J12.1 J12.2
5V_BUCK_C: J3.4 J11.1 J11.2 J11.3 J11.4 J13.1 J13.2 J31.1 J31.2
5V_IN: D14.1
12V_ELSE_IN: D16.1
12V_FANS_C: J10.1 J10.2 J30.1 J30.2
12V_FANS_IN: D15.1
12V_REST_C: J6.1 J6.2
18V_BUCK_C: J8.1 J8.2
18V_IN: D12.1
24V_BUCK_C: J9.1 J9.2
24V_BUCK_LA_C: J7.1 J7.2
24V_LA_IN: D13.1
GND: C30.2(NEG) D3.2 D12.2 D13.2 D14.2 D15.2 D16.2 GND.1 J2.P$1(1) J3.5 J3.6 J3.7 J3.8 J5.P$1(1) J6.3 J6.4 J7.3 J7.4 J8.3 J8.4 J9.3 J9.4 J10.3 J10.4 J11.5 J11.6 J11.7 J11.8 J12.3 J12.4 J13.3 J13.4 J30.3 J30.4 J31.3 J31.4 Q4.3(D) R27.2 X1.P$2
VBAT: C30.1(POS) D3.1 J4.1 R26.1 VBAT.1
AUTON_LED_B: J3.1 ; port AUTON_LED_B
AUTON_LED_G: J3.2 ; port AUTON_LED_G
AUTON_LED_R: J3.3 ; port AUTON_LED_R
CAN_N_PIN: J2.P$2(2) J5.P$2(2) ; port CAN_N  [project net CAN_N]
CAN_P_PIN: J2.P$3(3) J5.P$3(3) ; port CAN_P  [project net CAN_P]
RA_LASER_GND: X1.P$1 ; port RA_LASER_GND
NetJ4_2: J4.2 Q4.2(S)
NetQ4_1: Q4.1(G) R26.2 R27.1

### Notes on the sheet
- CAN
- (near J2) CAN 1
- REVERSE POLARITY CIRC.
- AUTON LED
- (near J5) CAN 2
- OUTPUT CONN.
- TEST POINTS
- TVS DIODES
- (in symbol CAP-100U-0002) +

### Library data of the parts
C30 = CAP-100U-0002: 100 µF 50 V Aluminum Electrolytic Capacitors Radial, Can 7000 Hrs @ 105°C
D3 = DIO-TVS-0001: TVS DIODE 40VWM 64.5VC DO214AA; ComponentLink1Description: Datasheet; ComponentLink1URL: https://www.littelfuse.com/media?resourcetype=datasheets&itemid=09a6ae9a-73cb-4ac4-acac-e6dab92ab953&filename=littelfuse_tvs_diode_smbj_datasheet.pdf
D12 = DIODE-18V-0001: 30.66V Clamp 20.6A Ipp Tvs Diode Surface Mount DO-214AA (SMBJ); Manufacturer_Name: Littelfuse Inc; Copyright: Copyright (C) 2025 Ultra Librarian. All rights reserved.; Manufacturer_Part_Number: SMBJ18
D13 = DIO-TVS-24V: 40.85V Clamp 15.5A Ipp Tvs Diode Surface Mount DO-214AA (SMBJ)
D14 = DIO-TVS-5V: 9.66V Clamp 65.3A Ipp Tvs Diode Surface Mount DO-214AA (SMBJ)
D15 D16 = DIO-TVS-12V: 20.9V Clamp 30.2A Ipp Tvs Diode Surface Mount DO-214AA (SMBJ)
GND VBAT = TEST-POINT-0001: Oranange PC Test Point, Miniature Phoisphor Bronze Silver Plating Through Hole Mounting Type
J2 J5 = Micro-Fit Molex 3 Pin Vertical: GateName_1: G$1; SymbolName_1: HEADER_POS3; DeviceSetName: HEADER_POS3_?; DeviceName: 43650-0315; LibraryName: con-molex-micro-fit-3_0_2; Package: 43650-0315
J3 J11 = CONN-8POS-0001: GateName_1: G$1; SymbolName_1: HEADER_POS8; DeviceSetName: HEADER_POS8_?; DeviceName: 43045-0812; LibraryName: con-molex-micro-fit-3_0_2; Package: 43045-0812
J4 = CONN-2POS-0003
J6-J10 J12 J13 J30 J31 = CONN-4POS-0002: CONN HEADER VERT 4POS 3MM; ComponentLink1Description: Datasheet; ComponentLink1URL: https://www.molex.com/content/dam/molex/molex-dot-com/products/automated/en-us/salesdrawingpdf/430/43045/430450412_sd.pdf?inline
Q4 = NMOS-60A-0001: MOSFET N-CH 60V 12A/60A 8VSON; ComponentLink2Description: Datasheet; ComponentLink2URL: http://www.ti.com/lit/ds/symlink/csd18543q3a.pdf
R26 = RES-200k-0001: RES SMD 200K OHM 1% 1/10W 0603; Tolerance: 1%; Size: 0603; ComponentLink1Description: Datasheet; ComponentLink1URL: https://www.yageo.com/upload/media/product/products/datasheet/rchip/PYu-RC_Group_51_RoHS_L_12.pdf
R27 = RES-100k-0001: RES SMD 100K OHM 1% 1/10W 0603; Tolerance: 1%; Size: 0603; ComponentLink1Description: Datasheet; ComponentLink1URL: https://www.yageo.com/upload/media/product/products/datasheet/rchip/PYu-RC_Group_51_RoHS_L_12.pdf
X1 = HEADER_POS2_?43045-0212: GateName_1: G$1; SymbolName_1: HEADER_POS2; DeviceName: 43045-0212; LibraryName: con-molex-micro-fit-3_0_2; DeviceSetName: HEADER_POS2_?; Package: 43045-0212

## Sheet Current_Sensing.SchDoc
size 381 x 241 mm; SheetNumber: 3; SheetTotal: 8
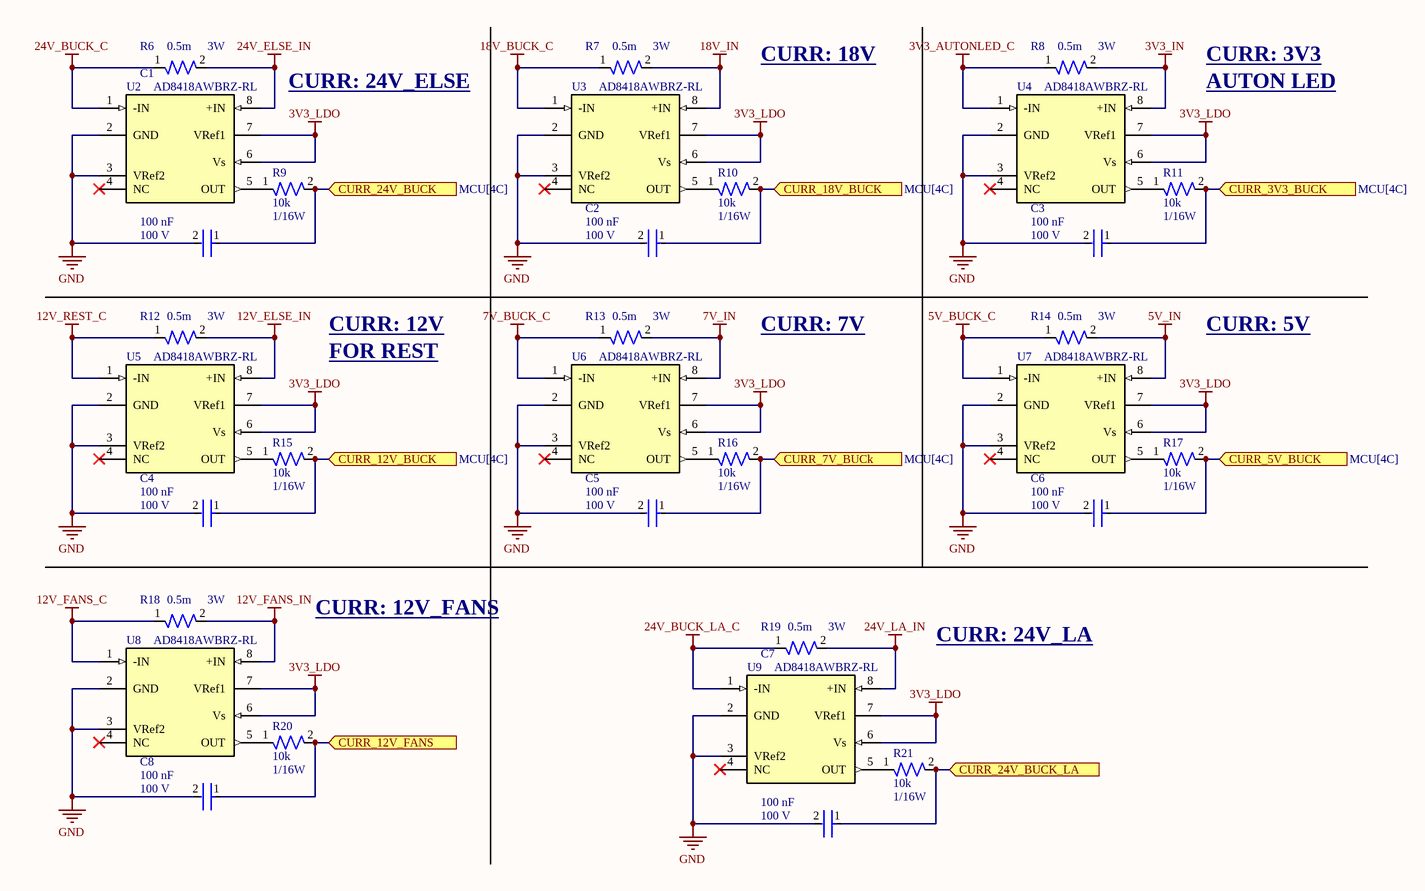
[diagram p11: Current_Sensing.SchDoc]

### Parts
C1  Capacitance: 100 nF  Voltage: 100 V  [CAP-0603]  (hidden comment: CC0603KRX7R0BB104)
C2  Capacitance: 100 nF  Voltage: 100 V  [CAP-0603]  (hidden comment: CC0603KRX7R0BB104)
C3  Capacitance: 100 nF  Voltage: 100 V  [CAP-0603]  (hidden comment: CC0603KRX7R0BB104)
C4  Capacitance: 100 nF  Voltage: 100 V  [CAP-0603]  (hidden comment: CC0603KRX7R0BB104)
C5  Capacitance: 100 nF  Voltage: 100 V  [CAP-0603]  (hidden comment: CC0603KRX7R0BB104)
C6  Capacitance: 100 nF  Voltage: 100 V  [CAP-0603]  (hidden comment: CC0603KRX7R0BB104)
C7  Capacitance: 100 nF  Voltage: 100 V  [CAP-0603]  (hidden comment: CC0603KRX7R0BB104)
C8  Capacitance: 100 nF  Voltage: 100 V  [CAP-0603]  (hidden comment: CC0603KRX7R0BB104)
R6  Power: 3W  Resistance: 0.5m  [RES-2512]  (hidden comment: CSNL2512FTL500)
R7  Power: 3W  Resistance: 0.5m  [RES-2512]  (hidden comment: CSNL2512FTL500)
R8  Power: 3W  Resistance: 0.5m  [RES-2512]  (hidden comment: CSNL2512FTL500)
R9  Resistance: 10k  Power: 1/16W  [RES-0402]  (hidden comment: RC0402FR-0710KL)
R10  Resistance: 10k  Power: 1/16W  [RES-0402]  (hidden comment: RC0402FR-0710KL)
R11  Resistance: 10k  Power: 1/16W  [RES-0402]  (hidden comment: RC0402FR-0710KL)
R12  Power: 3W  Resistance: 0.5m  [RES-2512]  (hidden comment: CSNL2512FTL500)
R13  Power: 3W  Resistance: 0.5m  [RES-2512]  (hidden comment: CSNL2512FTL500)
R14  Power: 3W  Resistance: 0.5m  [RES-2512]  (hidden comment: CSNL2512FTL500)
R15  Resistance: 10k  Power: 1/16W  [RES-0402]  (hidden comment: RC0402FR-0710KL)
R16  Resistance: 10k  Power: 1/16W  [RES-0402]  (hidden comment: RC0402FR-0710KL)
R17  Resistance: 10k  Power: 1/16W  [RES-0402]  (hidden comment: RC0402FR-0710KL)
R18  Power: 3W  Resistance: 0.5m  [RES-2512]  (hidden comment: CSNL2512FTL500)
R19  Power: 3W  Resistance: 0.5m  [RES-2512]  (hidden comment: CSNL2512FTL500)
R20  Resistance: 10k  Power: 1/16W  [RES-0402]  (hidden comment: RC0402FR-0710KL)
R21  Resistance: 10k  Power: 1/16W  [RES-0402]  (hidden comment: RC0402FR-0710KL)
U2  AD8418AWBRZ-RL  [IC-CURR]
U3  AD8418AWBRZ-RL  [IC-CURR]
U4  AD8418AWBRZ-RL  [IC-CURR]
U5  AD8418AWBRZ-RL  [IC-CURR]
U6  AD8418AWBRZ-RL  [IC-CURR]
U7  AD8418AWBRZ-RL  [IC-CURR]
U8  AD8418AWBRZ-RL  [IC-CURR]
U9  AD8418AWBRZ-RL  [IC-CURR]

### Ports
CURR_3V3_BUCK (in, see MCU[4C]), CURR_5V_BUCK (in, see MCU[4C]), CURR_7V_BUCk (in, see MCU[4C]), CURR_12V_BUCK (in, see MCU[4C]), CURR_12V_FANS (in), CURR_18V_BUCK (in, see MCU[4C]), CURR_24V_BUCK (in, see MCU[4C]), CURR_24V_BUCK_LA (in)

### Nets
3V3_AUTONLED_C: R8.1 U4.1(-IN)
3V3_IN: R8.2 U4.8(+IN)
3V3_LDO: U2.6(Vs) U2.7(VRef1) U3.6(Vs) U3.7(VRef1) U4.6(Vs) U4.7(VRef1) U5.6(Vs) U5.7(VRef1) U6.6(Vs) U6.7(VRef1) U7.6(Vs) U7.7(VRef1) U8.6(Vs) U8.7(VRef1) U9.6(Vs) U9.7(VRef1)  [project net VBAT_MCU]
5V_BUCK_C: R14.1 U7.1(-IN)
5V_IN: R14.2 U7.8(+IN)
7V_BUCK_C: R13.1 U6.1(-IN)
7V_IN: R13.2 U6.8(+IN)
12V_ELSE_IN: R12.2 U5.8(+IN)
12V_FANS_C: R18.1 U8.1(-IN)
12V_FANS_IN: R18.2 U8.8(+IN)
12V_REST_C: R12.1 U5.1(-IN)
18V_BUCK_C: R7.1 U3.1(-IN)
18V_IN: R7.2 U3.8(+IN)
24V_BUCK_C: R6.1 U2.1(-IN)
24V_BUCK_LA_C: R19.1 U9.1(-IN)
24V_ELSE_IN: R6.2 U2.8(+IN)
24V_LA_IN: R19.2 U9.8(+IN)
GND: C1.2 C2.2 C3.2 C4.2 C5.2 C6.2 C7.2 C8.2 U2.2(GND) U2.3(VRef2) U3.2(GND) U3.3(VRef2) U4.2(GND) U4.3(VRef2) U5.2(GND) U5.3(VRef2) U6.2(GND) U6.3(VRef2) U7.2(GND) U7.3(VRef2) U8.2(GND) U8.3(VRef2) U9.2(GND) U9.3(VRef2)
CURR_3V3_BUCK: C3.1 R11.2 ; port CURR_3V3_BUCK
CURR_5V_BUCK: C6.1 R17.2 ; port CURR_5V_BUCK
CURR_7V_BUCK: C5.1 R16.2 ; port CURR_7V_BUCk
CURR_12V_BUCK: C4.1 R15.2 ; port CURR_12V_BUCK
CURR_12V_BUCK_FANS: C8.1 R20.2 ; port CURR_12V_FANS
CURR_18V_BUCK: C2.1 R10.2 ; port CURR_18V_BUCK
CURR_24V_BUCK: C1.1 R9.2 ; port CURR_24V_BUCK
CURR_24V_BUCK_LA: C7.1 R21.2 ; port CURR_24V_BUCK_LA
NetR9_1: R9.1 U2.5(OUT)
NetR10_1: R10.1 U3.5(OUT)
NetR11_1: R11.1 U4.5(OUT)
NetR15_1: R15.1 U5.5(OUT)
NetR16_1: R16.1 U6.5(OUT)
NetR17_1: R17.1 U7.5(OUT)
NetR20_1: R20.1 U8.5(OUT)
NetR21_1: R21.1 U9.5(OUT)

Not connected (* = marked no-connect by the designer): U2 4(NC)*; U3 4(NC)*; U4 4(NC)*; U5 4(NC)*; U6 4(NC)*; U7 4(NC)*; U8 4(NC)*; U9 4(NC)*

### Notes on the sheet
- CURR: 24V_ELSE
- CURR: 18V
- CURR: 3V3
- AUTON LED
- CURR: 12V
- FOR REST
- CURR: 7V
- CURR: 5V
- CURR: 12V_FANS
- CURR: 24V_LA

### Library data of the parts
C1-C8 = CAP-100N-0001: CAP CER 0.1UF 100V X7R 0603; Device Class: Ceramic; Size: 0603; ComponentLink1Description: Datasheet; ComponentLink1URL: https://www.yageo.com/upload/media/product/app/datasheet/mlcc/upy-np0x7r_mv_100-to-630v.pdf
R6-R8 R12-R14 R18 R19 = RES-0.5m-0001: 2512 Chip Resistor - Surface Mount ROHS; Tolerance: 1%; Size: 0402; ComponentLink1Description: Datasheet; ComponentLink1URL: https://www.yageo.com/upload/media/product/products/datasheet/rchip/PYu-RC_Group_51_RoHS_L_12.pdf
R9-R11 R15-R17 R20 R21 = RES-10k-0001: RES 10K OHM 1% 1/16W 0402; Tolerance: 1%; Size: 0402; ComponentLink1Description: Datasheet; ComponentLink1URL: https://www.yageo.com/upload/media/product/products/datasheet/rchip/PYu-RC_Group_51_RoHS_L_12.pdf
U2-U9 = IC-CURR-0001: Current Sense Amplifier 1 Circuit 8-MSOP

## Sheet LDOs.SchDoc
size A; SheetNumber: 4; SheetTotal: 8
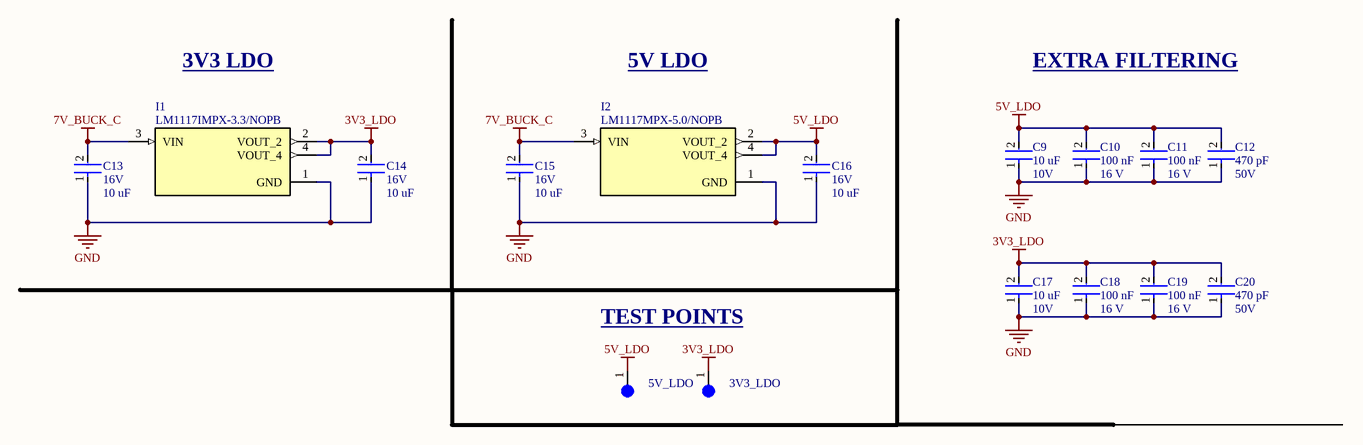
[diagram p12: LDOs.SchDoc]

### Parts
3V3_LDO  5003  [TEST-POINT-0001]  (value not drawn)
5V_LDO  5003  [TEST-POINT-0001]  (value not drawn)
C9  Voltage: 10V  Capacitance: 10 uF  [CAP-0603]  (hidden comment: CC0603KRX5R6BB106)
C10  Voltage Rating: 16 V  Capacitance: 100 nF  [CAP-0402]  (hidden comment: CC0402KRX7R7BB104)
C11  Voltage Rating: 16 V  Capacitance: 100 nF  [CAP-0402]  (hidden comment: CC0402KRX7R7BB104)
C12  Voltage: 50V  Capacitance: 470 pF  [CAP-0805]  (hidden comment: CC0805JRNPO9BN471)
C13  Voltage: 16V  Capacitance: 10 uF  [CAP-1206]  (hidden comment: 293D106X9016A2TE3)
C14  Voltage: 16V  Capacitance: 10 uF  [CAP-1206]  (hidden comment: 293D106X9016A2TE3)
C15  Voltage: 16V  Capacitance: 10 uF  [CAP-1206]  (hidden comment: 293D106X9016A2TE3)
C16  Voltage: 16V  Capacitance: 10 uF  [CAP-1206]  (hidden comment: 293D106X9016A2TE3)
C17  Voltage: 10V  Capacitance: 10 uF  [CAP-0603]  (hidden comment: CC0603KRX5R6BB106)
C18  Voltage Rating: 16 V  Capacitance: 100 nF  [CAP-0402]  (hidden comment: CC0402KRX7R7BB104)
C19  Voltage Rating: 16 V  Capacitance: 100 nF  [CAP-0402]  (hidden comment: CC0402KRX7R7BB104)
C20  Voltage: 50V  Capacitance: 470 pF  [CAP-0805]  (hidden comment: CC0805JRNPO9BN471)
I1  LM1117IMPX-3.3/NOPB  [IC-SOT-223-4]
I2  LM1117MPX-5.0/NOPB  [IC-SOT-223-4]

### Nets
3V3_LDO: 3V3_LDO.1 C14.2 C17.2 C18.2 C19.2 C20.2 I1.2(VOUT_2) I1.4(VOUT_4)  [project net VBAT_MCU]
5V_LDO: 5V_LDO.1 C9.2 C10.2 C11.2 C12.2 C16.2 I2.2(VOUT_2) I2.4(VOUT_4)
7V_BUCK_C: C13.2 C15.2 I1.3(VIN) I2.3(VIN)
GND: C9.1 C10.1 C11.1 C12.1 C13.1 C14.1 C15.1 C16.1 C17.1 C18.1 C19.1 C20.1 I1.1(GND) I2.1(GND)

### Notes on the sheet
- 3V3 LDO
- 5V LDO
- EXTRA FILTERING
- TEST POINTS

### Library data of the parts
3V3_LDO 5V_LDO = TEST-POINT-0001: as GND on sheet Other_Connectors
C9 C17 = CAP-10U-0001: CAP CER 10UF 10V X5R 0603; ComponentLink1Description: Datasheet; ComponentLink1URL: https://www.yageo.com/upload/media/product/app/datasheet/mlcc/upy-gphc_x5r_4v-to-50v.pdf; Device Class: Ceramic; Size: 0603
C10 C11 C18 C19 = CAP-0.1U-0001: CAP CER 0.1UF 16V X7R 0402; ComponentLink2Description: Datasheet; ComponentLink2URL: https://www.yageo.com/upload/media/product/productsearch/datasheet/mlcc/UPY-GPHC_X7R_6.3V-to-250V_24.pdf; Device Class: Ceramic; Size: 0402
C12 C20 = CAP-470P-0001: CAP CER 470PF 50V C0G/NPO 0805; Device Class: Ceramic; Size: 0805; ComponentLink1Description: Datasheet; ComponentLink1URL: https://www.yageo.com/upload/media/product/productsearch/datasheet/mlcc/UPY-GP_NP0_16V-to-50V_18.pdf
C13-C16 = CAP-10U-0004: CAP TANT 10UF 10% 16V 1206; Device Class: Tantalum; Size: 1206; ComponentLink1Description: Datasheet; ComponentLink1URL: https://www.lcsc.com/datasheet/lcsc_datasheet_2304140030_Vishay-Intertech-293D106X9016A2TE3_C110038.pdf
I1 = IC_LDO_3V3_0001: IC REG LIN 3.3V 800MA SOT223-4; ComponentLink1Description: New link; ComponentLink1URL: https://www.ti.com/lit/ds/symlink/lm1117.pdf?HQS=dis-dk-null-digikeymode-dsf-pf-null-wwe&ts=1721700739746
I2 = IC_LDO_5V_0001: IC REG LINEAR 5V 800MA SOT223-4; ComponentLink1Description: Datasheet; ComponentLink1URL: https://www.ti.com/lit/ds/symlink/lm1117.pdf?HQS=dis-dk-null-digikeymode-dsf-pf-null-wwe&ts=1721700739746

## Sheet CAN_Transciever.SchDoc
size A; SheetNumber: 2; SheetTotal: 8
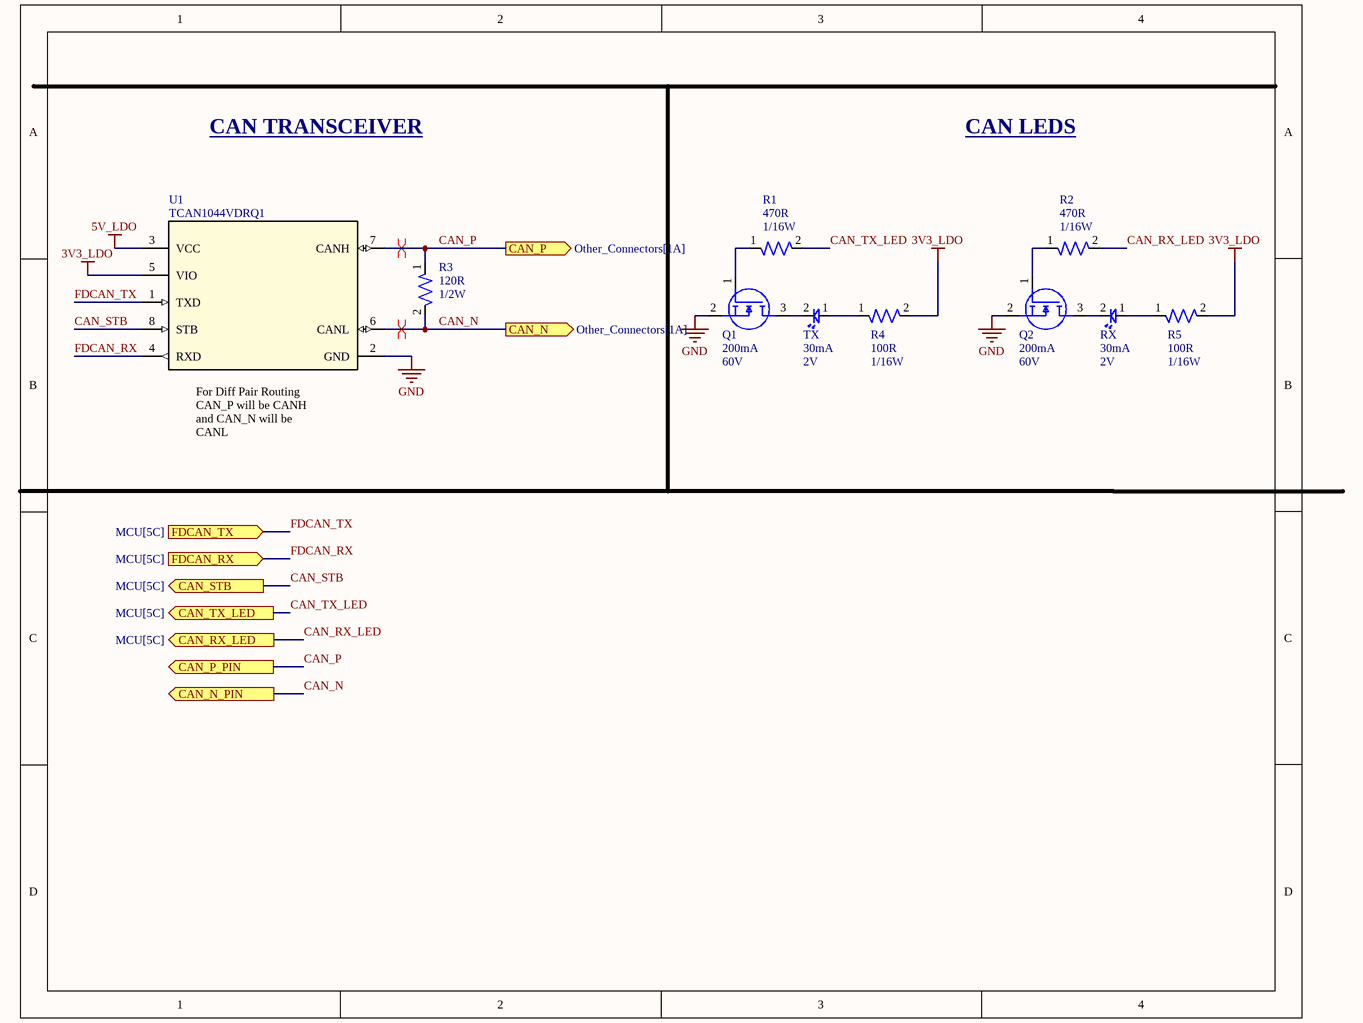
[diagram p13: CAN_Transciever.SchDoc]

### Parts
Q1  Continuous Current: 200mA  Voltage: 60V  [IC-SOT23-3]  (hidden comment: T2N7002AK,LM)
Q2  Continuous Current: 200mA  Voltage: 60V  [IC-SOT23-3]  (hidden comment: T2N7002AK,LM)
R1  Power: 1/16W  Resistance: 470R  [RES-0402]  (hidden comment: RC0402FR-07470RL)
R2  Power: 1/16W  Resistance: 470R  [RES-0402]  (hidden comment: RC0402FR-07470RL)
R3  Power: 1/2W  Resistance: 120R  [RES-1210]  (hidden comment: RC1210FR-07120RL)
R4  Power: 1/16W  Resistance: 100R  [RES-0402]  (hidden comment: RC0402FR-07100RL)
R5  Power: 1/16W  Resistance: 100R  [RES-0402]  (hidden comment: RC0402FR-07100RL)
RX  Forward Current: 30mA  Forward Voltage: 2V  [LED-0603]  (hidden comment: BL-HKC36G-AV-TRB)
TX  Forward Current: 30mA  Forward Voltage: 2V  [LED-0603]  (hidden comment: BL-HKC36G-AV-TRB)
U1  TCAN1044VDRQ1  [IC-8SOIC]

### Ports
CAN_N (out, see Other_Connectors[1A]), CAN_N_PIN (out), CAN_P (out, see Other_Connectors[1A]), CAN_P_PIN (out), CAN_RX_LED (out, see MCU[5C]), CAN_STB (out, see MCU[5C]), CAN_TX_LED (out, see MCU[5C]), FDCAN_RX (in, see MCU[5C]), FDCAN_TX (in, see MCU[5C])

### Nets
3V3_LDO: R4.2 R5.2 U1.5(VIO)  [project net VBAT_MCU]
5V_LDO: U1.3(VCC)
GND: Q1.2(S) Q2.2(S) U1.2(GND)
CAN_N: R3.2 U1.6(CANL) ; port CAN_N_PIN, port CAN_N
CAN_P: R3.1 U1.7(CANH) ; port CAN_P_PIN, port CAN_P
CAN_RX_LED: R2.2 ; port CAN_RX_LED
CAN_STB: U1.8(STB) ; port CAN_STB
CAN_TX_LED: R1.2 ; port CAN_TX_LED
FDCAN_RX: U1.4(RXD) ; port FDCAN_RX
FDCAN_TX: U1.1(TXD) ; port FDCAN_TX
NetQ1_1: Q1.1(G) R1.1
NetQ1_3: Q1.3(D) TX.2
NetQ2_1: Q2.1(G) R2.1
NetQ2_3: Q2.3(D) RX.2
NetR4_1: R4.1 TX.1
NetR5_1: R5.1 RX.1

### Layout directives
differential pair: CAN_N, CAN_P

### Notes on the sheet
- CAN TRANSCEIVER
- CAN LEDS
- (near U1) For Diff Pair Routing CAN_P will be CANH and CAN_N will be CANL

### Library data of the parts
Q1 Q2 = NMOS-200MA-0001: MOSFET N-CH 60V 200MA SOT23; ComponentLink1Description: Datasheet; ComponentLink1URL: https://toshiba.semicon-storage.com/info/T2N7002AK_datasheet_en_20150401.pdf?did=29712&prodName=T2N7002AK
R1 R2 = RES-470-0001: RES 470 OHM 1% 1/16W 0402; Tolerance: 1%; Size: 0402; ComponentLink1Description: Datasheet; ComponentLink1URL: https://www.yageo.com/upload/media/product/products/datasheet/rchip/PYu-RC_Group_51_RoHS_L_12.pdf
R3 = RES-120-0001: RES 120 OHM 1% 1/2W 1210; Tolerance: 1%; Size: 1210; ComponentLink1Description: Datasheet; ComponentLink1URL: https://www.yageo.com/upload/media/product/products/datasheet/rchip/PYu-RC_Group_51_RoHS_L_12.pdf
R4 R5 = RES-100-0001: RES 100 OHM 1% 1/16W 0402; Tolerance: 1%; Size: 0402; ComponentLink1Description: Datasheet; ComponentLink1URL: https://www.yageo.com/upload/media/product/products/datasheet/rchip/PYu-RC_Group_51_RoHS_L_12.pdf
RX TX = LED-0001: LED YELLOW CLEAR 0603 SMD; ComponentLink1Description: Datasheet; ComponentLink1URL: https://www.americanbrightled.com/pdffiles/led-components/smt/BL-HKC36G-AV-TRB.pdf
U1 = IC-CAN-0001: IC TRANSCEIVER 1/1 8SOIC; ComponentLink1Description: Datasheet; ComponentLink1URL: https://www.ti.com/lit/ds/symlink/tcan1044-q1.pdf?HQS=dis-dk-null-digikeymode-dsf-pf-null-wwe&ts=1728758303289&ref_url=https%253A%252F%252Fwww.ti.com%252Fgeneral%252Fdocs%252Fsuppproductinfo.tsp%253FdistId%253D10%2526gotoUrl%253Dhttps%253A%252F%252Fwww.ti.com%252Flit%252Fgpn%252Ftcan1044-q1

## Sheet PGOODs.SchDoc
size A; SheetNumber: 7; SheetTotal: 8
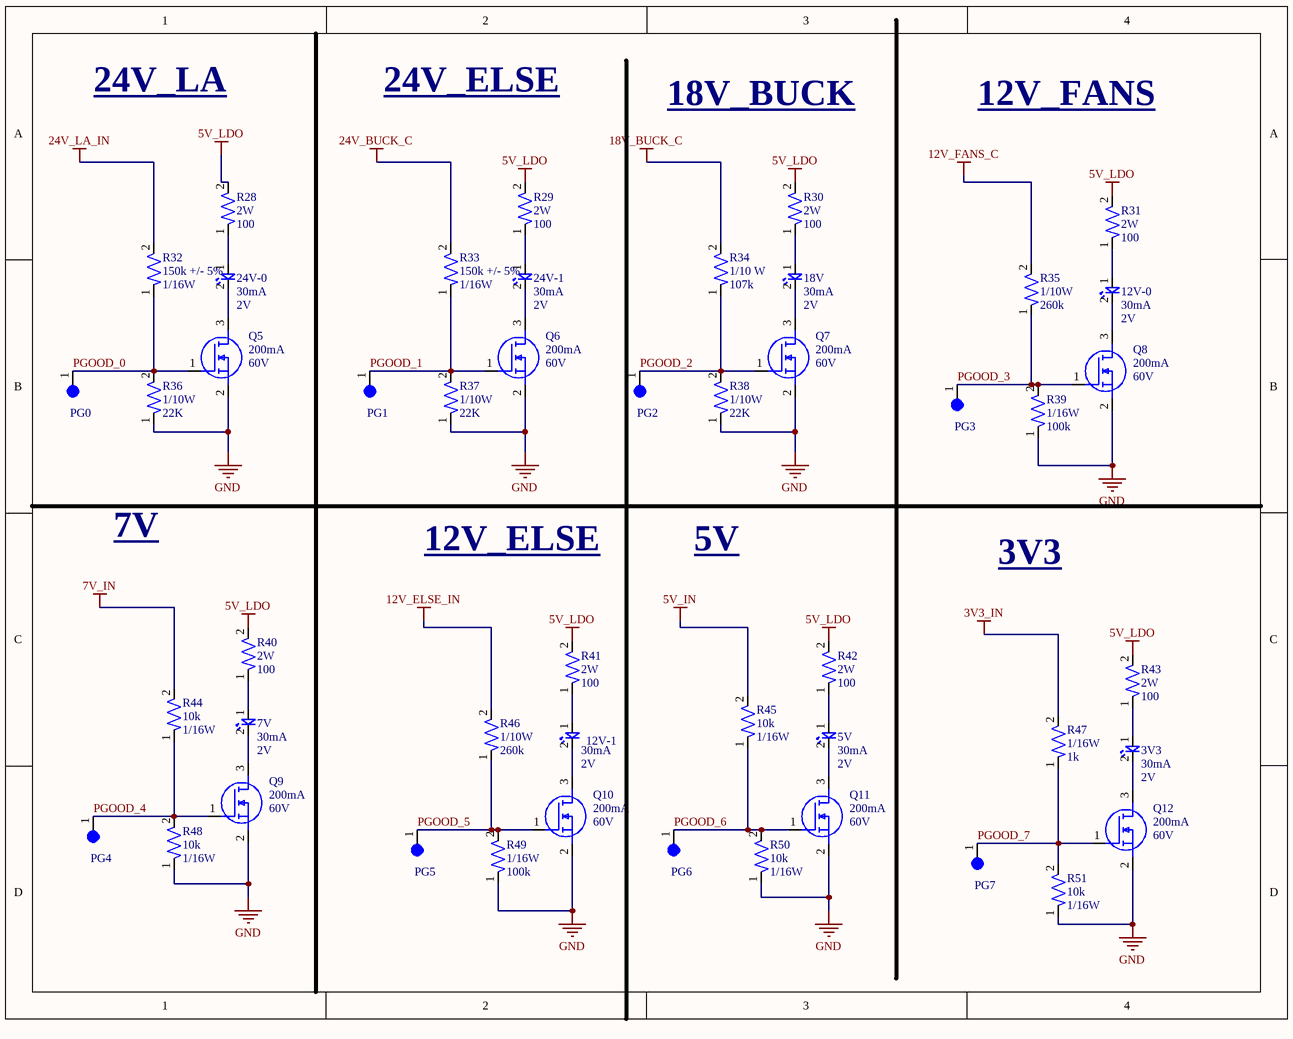
[diagram p14: PGOODs.SchDoc]

### Parts
3V3  Forward Current: 30mA  Forward Voltage: 2V  [LED-0603]  (hidden comment: BL-HKC36G-AV-TRB)
5V  Forward Current: 30mA  Forward Voltage: 2V  [LED-0603]  (hidden comment: BL-HKC36G-AV-TRB)
7V  Forward Current: 30mA  Forward Voltage: 2V  [LED-0603]  (hidden comment: BL-HKC36G-AV-TRB)
12V-0  Forward Current: 30mA  Forward Voltage: 2V  [LED-0603]  (hidden comment: BL-HKC36G-AV-TRB)
12V-1  Forward Current: 30mA  Forward Voltage: 2V  [LED-0603]  (hidden comment: BL-HKC36G-AV-TRB)
18V  Forward Current: 30mA  Forward Voltage: 2V  [LED-0603]  (hidden comment: BL-HKC36G-AV-TRB)
24V-0  Forward Current: 30mA  Forward Voltage: 2V  [LED-0603]  (hidden comment: BL-HKC36G-AV-TRB)
24V-1  Forward Current: 30mA  Forward Voltage: 2V  [LED-0603]  (hidden comment: BL-HKC36G-AV-TRB)
PG0  5003  [TEST-POINT-0001]  (value not drawn)
PG1  5003  [TEST-POINT-0001]  (value not drawn)
PG2  5003  [TEST-POINT-0001]  (value not drawn)
PG3  5003  [TEST-POINT-0001]  (value not drawn)
PG4  5003  [TEST-POINT-0001]  (value not drawn)
PG5  5003  [TEST-POINT-0001]  (value not drawn)
PG6  5003  [TEST-POINT-0001]  (value not drawn)
PG7  5003  [TEST-POINT-0001]  (value not drawn)
Q5  Continuous Current: 200mA  Voltage: 60V  [IC-SOT23-3]  (hidden comment: T2N7002AK,LM)
Q6  Continuous Current: 200mA  Voltage: 60V  [IC-SOT23-3]  (hidden comment: T2N7002AK,LM)
Q7  Continuous Current: 200mA  Voltage: 60V  [IC-SOT23-3]  (hidden comment: T2N7002AK,LM)
Q8  Continuous Current: 200mA  Voltage: 60V  [IC-SOT23-3]  (hidden comment: T2N7002AK,LM)
Q9  Continuous Current: 200mA  Voltage: 60V  [IC-SOT23-3]  (hidden comment: T2N7002AK,LM)
Q10  Continuous Current: 200mA  Voltage: 60V  [IC-SOT23-3]  (hidden comment: T2N7002AK,LM)
Q11  Continuous Current: 200mA  Voltage: 60V  [IC-SOT23-3]  (hidden comment: T2N7002AK,LM)
Q12  Continuous Current: 200mA  Voltage: 60V  [IC-SOT23-3]  (hidden comment: T2N7002AK,LM)
R28  Power: 2W  Resistance: 100  [RES-2512]  (hidden comment: SR2512JK-7W100RL)
R29  Power: 2W  Resistance: 100  [RES-2512]  (hidden comment: SR2512JK-7W100RL)
R30  Power: 2W  Resistance: 100  [RES-2512]  (hidden comment: SR2512JK-7W100RL)
R31  Power: 2W  Resistance: 100  [RES-2512]  (hidden comment: SR2512JK-7W100RL)
R32  Resistance: 150k +/- 5%  Power: 1/16W  [RES-0402]  (hidden comment: RC0603FR-0722KL)
R33  Resistance: 150k +/- 5%  Power: 1/16W  [RES-0402]  (hidden comment: *RC0402JR-07150KL)
R34  Power: 1/10 W  Resistance: 107k  [RES-0603]  (hidden comment: RC0603FR-07107KL)
R35  Power: 1/10W  Resistance: 260k  [RES-0402]  (hidden comment: ERJ-2RKF2743X)
R36  Power: 1/10W  Resistance: 22K  [RES-0603]  (hidden comment: RC0603FR-0722KL)
R37  Power: 1/10W  Resistance: 22K  [RES-0603]  (hidden comment: RC0603FR-0722KL)
R38  Power: 1/10W  Resistance: 22K  [RES-0603]  (hidden comment: RC0603FR-0722KL)
R39  Power: 1/16W  Resistance: 100k  [RES-0402]  (hidden comment: RC0402FR-07100KL)
R40  Power: 2W  Resistance: 100  [RES-2512]  (hidden comment: SR2512JK-7W100RL)
R41  Power: 2W  Resistance: 100  [RES-2512]  (hidden comment: SR2512JK-7W100RL)
R42  Power: 2W  Resistance: 100  [RES-2512]  (hidden comment: SR2512JK-7W100RL)
R43  Power: 2W  Resistance: 100  [RES-2512]  (hidden comment: SR2512JK-7W100RL)
R44  Resistance: 10k  Power: 1/16W  [RES-0402]  (hidden comment: RC0402FR-0710KL)
R45  Resistance: 10k  Power: 1/16W  [RES-0402]  (hidden comment: RC0402FR-0710KL)
R46  Power: 1/10W  Resistance: 260k  [RES-0402]  (hidden comment: ERJ-2RKF2743X)
R47  Power: 1/16W  Resistance: 1k  [RES-0402]  (hidden comment: RC0402FR-071KL)
R48  Resistance: 10k  Power: 1/16W  [RES-0402]  (hidden comment: RC0402FR-0710KL)
R49  Power: 1/16W  Resistance: 100k  [RES-0402]  (hidden comment: RC0402FR-07100KL)
R50  Resistance: 10k  Power: 1/16W  [RES-0402]  (hidden comment: RC0402FR-0710KL)
R51  Resistance: 10k  Power: 1/16W  [RES-0402]  (hidden comment: RC0402FR-0710KL)

### Nets
3V3_IN: R47.2
5V_IN: R45.2
5V_LDO: R28.2 R29.2 R30.2 R31.2 R40.2 R41.2 R42.2 R43.2
7V_IN: R44.2
12V_ELSE_IN: R46.2
12V_FANS_C: R35.2
18V_BUCK_C: R34.2
24V_BUCK_C: R33.2
24V_LA_IN: R32.2
GND: Q5.2(S) Q6.2(S) Q7.2(S) Q8.2(S) Q9.2(S) Q10.2(S) Q11.2(S) Q12.2(S) R36.1 R37.1 R38.1 R39.1 R48.1 R49.1 R50.1 R51.1
PGOOD_0: PG0.1 Q5.1(G) R32.1 R36.2
PGOOD_1: PG1.1 Q6.1(G) R33.1 R37.2
PGOOD_2: PG2.1 Q7.1(G) R34.1 R38.2
PGOOD_3: PG3.1 Q8.1(G) R35.1 R39.2
PGOOD_4: PG4.1 Q9.1(G) R44.1 R48.2
PGOOD_5: PG5.1 Q10.1(G) R46.1 R49.2
PGOOD_6: PG6.1 Q11.1(G) R45.1 R50.2
PGOOD_7: PG7.1 Q12.1(G) R47.1 R51.2
Net3V3_1: 3V3.1 R43.1
Net3V3_2: 3V3.2 Q12.3(D)
Net5V_1: 5V.1 R42.1
Net5V_2: 5V.2 Q11.3(D)
Net7V_1: 7V.1 R40.1
Net7V_2: 7V.2 Q9.3(D)
Net12V-0_1: 12V-0.1 R31.1
Net12V-0_2: 12V-0.2 Q8.3(D)
Net12V-1_1: 12V-1.1 R41.1
Net12V-1_2: 12V-1.2 Q10.3(D)
Net18V_1: 18V.1 R30.1
Net18V_2: 18V.2 Q7.3(D)
Net24V-0_1: 24V-0.1 R28.1
Net24V-0_2: 24V-0.2 Q5.3(D)
Net24V-1_1: 24V-1.1 R29.1
Net24V-1_2: 24V-1.2 Q6.3(D)

### Notes on the sheet
- 24V_LA
- 24V_ELSE
- 18V_BUCK
- 12V_FANS
- 7V
- 12V_ELSE
- 5V
- 3V3

### Library data of the parts
3V3 5V 7V 12V-0 12V-1 18V 24V-0 24V-1 = LED-0001: LED YELLOW CLEAR 0603 SMD; ComponentLink1Description: Datasheet; ComponentLink1URL: https://www.americanbrightled.com/pdffiles/led-components/smt/BL-HKC36G-AV-TRB.pdf
PG0-PG7 = TEST-POINT-0001: as GND on sheet Other_Connectors
Q5-Q12 = NMOS-200MA-0001: MOSFET N-CH 60V 200MA SOT23; ComponentLink1Description: Datasheet; ComponentLink1URL: https://toshiba.semicon-storage.com/info/T2N7002AK_datasheet_en_20150401.pdf?did=29712&prodName=T2N7002AK
R28-R31 R40-R43 = RES-100-0002: 100 Ohms ±5% 2W Chip Resistor 2512 (6332 Metric) Automotive AEC-Q200, Pulse Withstanding Thick Film
R32 R33 = RES-150K-0001: 150 kOhms ±5% 0.063W, 1/16W Chip Resistor 0402 (1005 Metric) Moisture Resistant Thick Film
R34 = RES-107k-0001: 107 kOhms ±1% 0.1W, 1/10W Chip Resistor 0603 (1608 Metric) Moisture Resistant Thick Film
R35 R46 = RES-260k-0001: RES SMD 274K OHM 1% 1/10W 0402
R36-R38 = RES-22k-0001: 22 kOhms ±1% 0.1W, 1/10W Chip Resistor 0603 (1608 Metric) Moisture Resistant Thick Film; Parameter 1: *
R39 R49 = RES-100k-0002: 100 kOhms ±1% 0.063W, 1/16W Chip Resistor 0402 (1005 Metric) Moisture Resistant Thick Film
R44 R45 R48 R50 R51 = RES-10k-0001: RES 10K OHM 1% 1/16W 0402; Tolerance: 1%; Size: 0402; ComponentLink1Description: Datasheet; ComponentLink1URL: https://www.yageo.com/upload/media/product/products/datasheet/rchip/PYu-RC_Group_51_RoHS_L_12.pdf
R47 = RES-1k-0001: RES 1K OHM 1% 1/16W 0402; Tolerance: 1%; Size: 0402; ComponentLink1Description: Datasheet; ComponentLink1URL: https://www.yageo.com/upload/media/product/products/datasheet/rchip/PYu-RC_Group_51_RoHS_L_12.pdf